# EAGLE design keyboard (EAGLE 9.5.1)

## Sheet 1 of 5
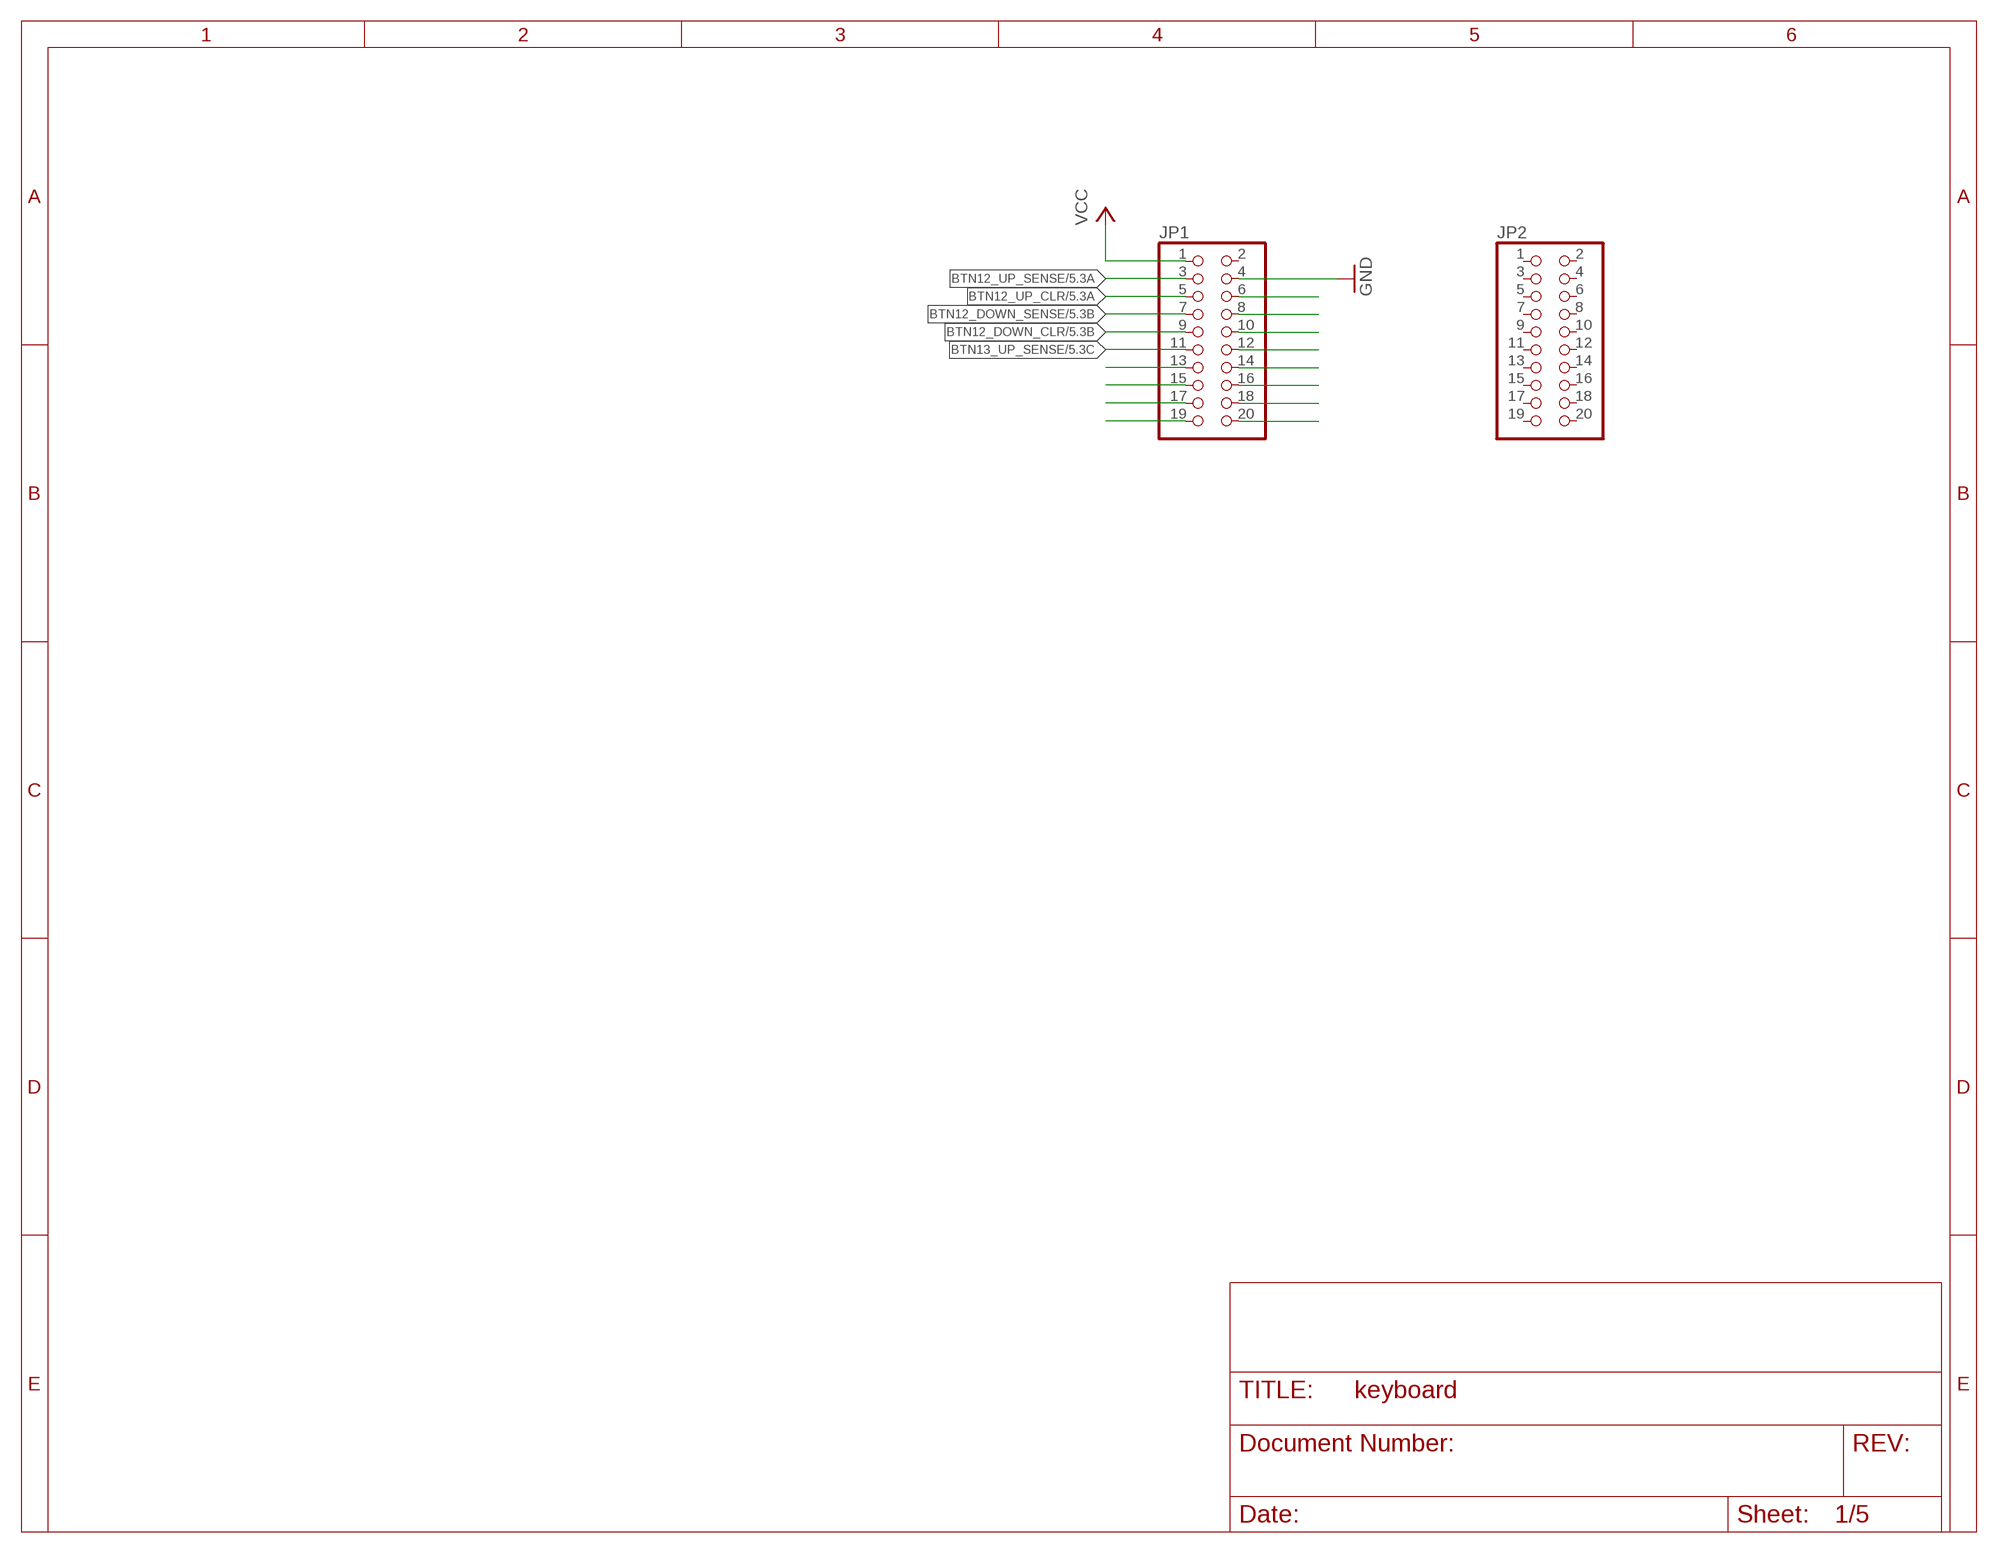
[diagram p0: schematic, sheet 1]

### Parts
JP1  PINHD-2X10  [2X10]
JP2  PINHD-2X10  [2X10]

### Nets
BTN12_DOWN_CLR: JP1.9 ; also sheet 5
BTN12_DOWN_SENSE: JP1.7 ; also sheet 5
BTN12_UP_CLR: JP1.5 ; also sheet 5
BTN12_UP_SENSE: JP1.3 ; also sheet 5
BTN13_UP_SENSE: JP1.11 ; also sheet 5
GND: JP1.4 ; also sheet 2,3,4,5
N$4: JP1.6
N$5: JP1.8
N$6: JP1.10
N$7: JP1.12
N$10: JP1.13
N$11: JP1.15
N$12: JP1.17
N$13: JP1.19
N$14: JP1.14
N$15: JP1.16
N$16: JP1.18
N$17: JP1.20
VCC: JP1.1 ; also sheet 2,3,4,5
Unconnected: JP1.2 JP2.1 JP2.2 JP2.3 JP2.4 JP2.5 JP2.6 JP2.7 JP2.8 JP2.9 JP2.10 JP2.11 JP2.12 JP2.13 JP2.14 JP2.15 JP2.16 JP2.17 JP2.18 JP2.19 JP2.20

## Sheet 2 of 5
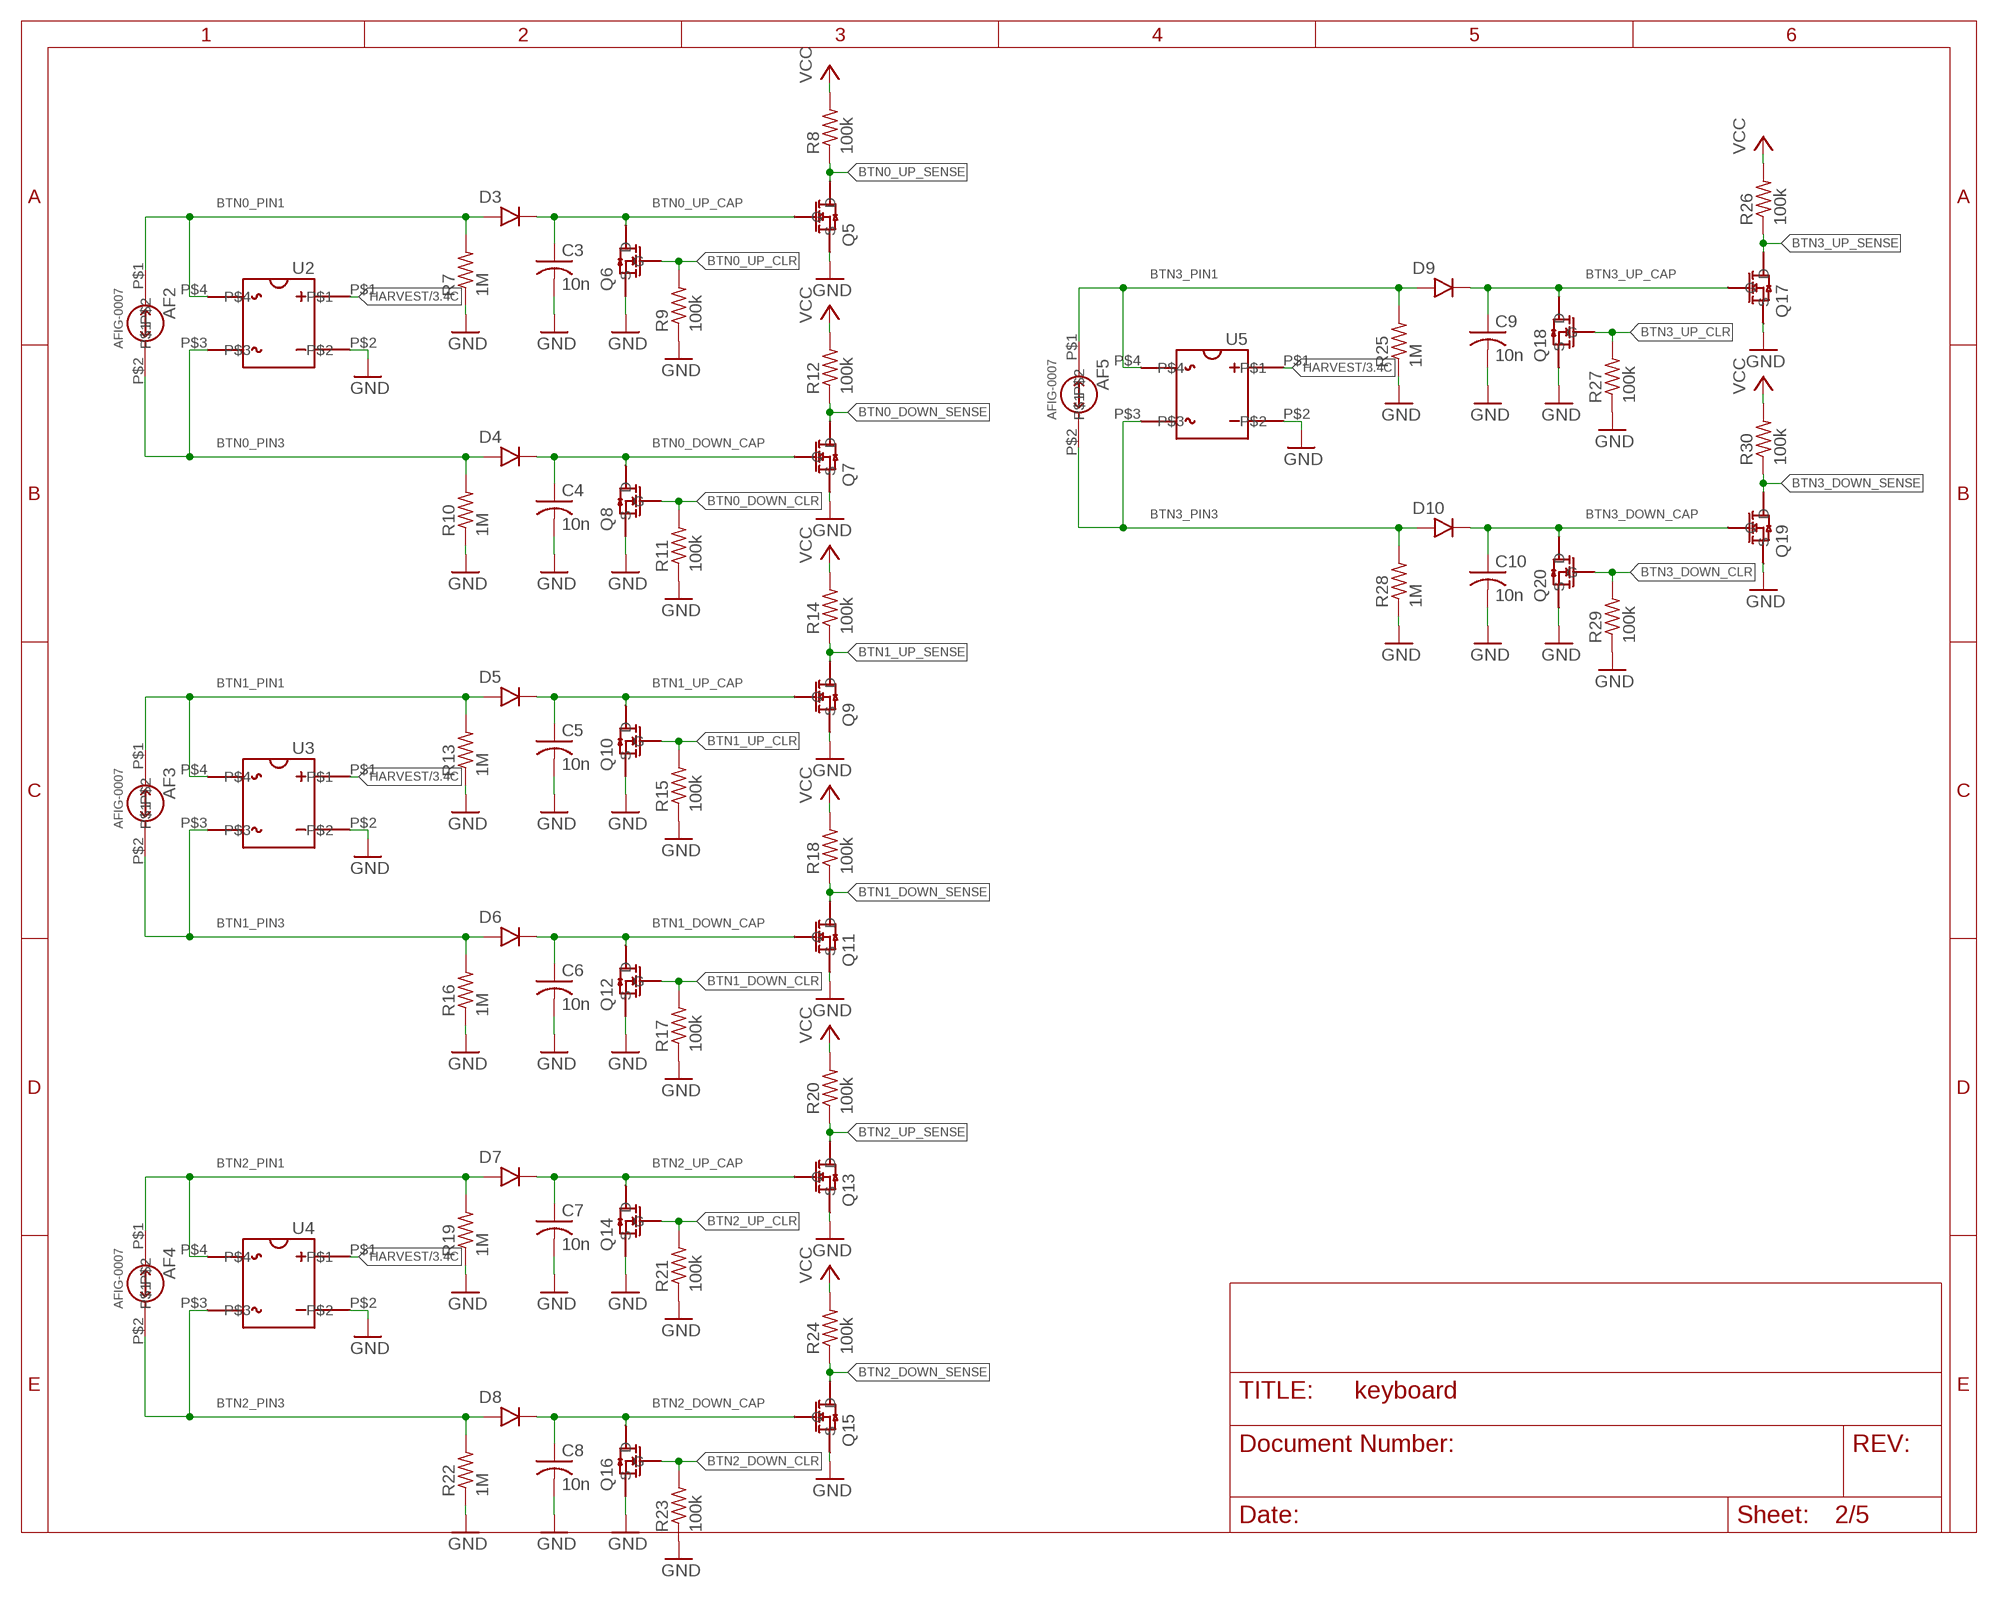
[diagram p1: schematic, sheet 2]

### Parts
AF2  BUTTON-MOUNT  [BUTTON-MOUNT]
AF3  BUTTON-MOUNT  [BUTTON-MOUNT]
AF4  BUTTON-MOUNT  [BUTTON-MOUNT]
AF5  BUTTON-MOUNT  [BUTTON-MOUNT]
C3  10n  C-USC0402  [C0402]
C4  10n  C-USC0402  [C0402]
C5  10n  C-USC0402  [C0402]
C6  10n  C-USC0402  [C0402]
C7  10n  C-USC0402  [C0402]
C8  10n  C-USC0402  [C0402]
C9  10n  C-USC0402  [C0402]
C10  10n  C-USC0402  [C0402]
D3  DFLU1200  [DFLU1200]
D4  DFLU1200  [DFLU1200]
D5  DFLU1200  [DFLU1200]
D6  DFLU1200  [DFLU1200]
D7  DFLU1200  [DFLU1200]
D8  DFLU1200  [DFLU1200]
D9  DFLU1200  [DFLU1200]
D10  DFLU1200  [DFLU1200]
Q5  2N7002K-7  [2N7002K-7]
Q6  BSS138K  [BSS138K]
Q7  2N7002K-7  [2N7002K-7]
Q8  BSS138K  [BSS138K]
Q9  2N7002K-7  [2N7002K-7]
Q10  BSS138K  [BSS138K]
Q11  2N7002K-7  [2N7002K-7]
Q12  BSS138K  [BSS138K]
Q13  2N7002K-7  [2N7002K-7]
Q14  BSS138K  [BSS138K]
Q15  2N7002K-7  [2N7002K-7]
Q16  BSS138K  [BSS138K]
Q17  2N7002K-7  [2N7002K-7]
Q18  BSS138K  [BSS138K]
Q19  2N7002K-7  [2N7002K-7]
Q20  BSS138K  [BSS138K]
R7  1M  R-US_R0402  [R0402]
R8  100k  R-US_R0402  [R0402]
R9  100k  R-US_R0402  [R0402]
R10  1M  R-US_R0402  [R0402]
R11  100k  R-US_R0402  [R0402]
R12  100k  R-US_R0402  [R0402]
R13  1M  R-US_R0402  [R0402]
R14  100k  R-US_R0402  [R0402]
R15  100k  R-US_R0402  [R0402]
R16  1M  R-US_R0402  [R0402]
R17  100k  R-US_R0402  [R0402]
R18  100k  R-US_R0402  [R0402]
R19  1M  R-US_R0402  [R0402]
R20  100k  R-US_R0402  [R0402]
R21  100k  R-US_R0402  [R0402]
R22  1M  R-US_R0402  [R0402]
R23  100k  R-US_R0402  [R0402]
R24  100k  R-US_R0402  [R0402]
R25  1M  R-US_R0402  [R0402]
R26  100k  R-US_R0402  [R0402]
R27  100k  R-US_R0402  [R0402]
R28  1M  R-US_R0402  [R0402]
R29  100k  R-US_R0402  [R0402]
R30  100k  R-US_R0402  [R0402]
U2  CDBHD140L-G  [CDBHDXX0L-G]
U3  CDBHD140L-G  [CDBHDXX0L-G]
U4  CDBHD140L-G  [CDBHDXX0L-G]
U5  CDBHD140L-G  [CDBHDXX0L-G]

### Nets
BTN0_DOWN_CAP: C4.1 D4.K Q7.G Q8.D
BTN0_DOWN_CLR: Q8.G R11.2
BTN0_DOWN_SENSE: Q7.D R12.1
BTN0_PIN1: AF2.P$1 D3.A R7.2 U2.P$4
BTN0_PIN3: AF2.P$2 D4.A R10.2 U2.P$3
BTN0_UP_CAP: C3.1 D3.K Q5.G Q6.D
BTN0_UP_CLR: Q6.G R9.2
BTN0_UP_SENSE: Q5.D R8.1
BTN1_DOWN_CAP: C6.1 D6.K Q11.G Q12.D
BTN1_DOWN_CLR: Q12.G R17.2
BTN1_DOWN_SENSE: Q11.D R18.1
BTN1_PIN1: AF3.P$1 D5.A R13.2 U3.P$4
BTN1_PIN3: AF3.P$2 D6.A R16.2 U3.P$3
BTN1_UP_CAP: C5.1 D5.K Q9.G Q10.D
BTN1_UP_CLR: Q10.G R15.2
BTN1_UP_SENSE: Q9.D R14.1
BTN2_DOWN_CAP: C8.1 D8.K Q15.G Q16.D
BTN2_DOWN_CLR: Q16.G R23.2
BTN2_DOWN_SENSE: Q15.D R24.1
BTN2_PIN1: AF4.P$1 D7.A R19.2 U4.P$4
BTN2_PIN3: AF4.P$2 D8.A R22.2 U4.P$3
BTN2_UP_CAP: C7.1 D7.K Q13.G Q14.D
BTN2_UP_CLR: Q14.G R21.2
BTN2_UP_SENSE: Q13.D R20.1
BTN3_DOWN_CAP: C10.1 D10.K Q19.G Q20.D
BTN3_DOWN_CLR: Q20.G R29.2
BTN3_DOWN_SENSE: Q19.D R30.1
BTN3_PIN1: AF5.P$1 D9.A R25.2 U5.P$4
BTN3_PIN3: AF5.P$2 D10.A R28.2 U5.P$3
BTN3_UP_CAP: C9.1 D9.K Q17.G Q18.D
BTN3_UP_CLR: Q18.G R27.2
BTN3_UP_SENSE: Q17.D R26.1
GND: C3.2 C4.2 C5.2 C6.2 C7.2 C8.2 C9.2 C10.2 Q5.S Q6.S Q7.S Q8.S Q9.S Q10.S Q11.S Q12.S Q13.S Q14.S Q15.S Q16.S Q17.S Q18.S Q19.S Q20.S R7.1 R9.1 R10.1 R11.1 R13.1 R15.1 R16.1 R17.1 R19.1 R21.1 R22.1 R23.1 R25.1 R27.1 R28.1 R29.1 U2.P$2 U3.P$2 U4.P$2 U5.P$2 ; also sheet 1,3,4,5
HARVEST: U2.P$1 U3.P$1 U4.P$1 U5.P$1 ; also sheet 3,4,5
VCC: R8.2 R12.2 R14.2 R18.2 R20.2 R24.2 R26.2 R30.2 ; also sheet 1,3,4,5

## Sheet 3 of 5
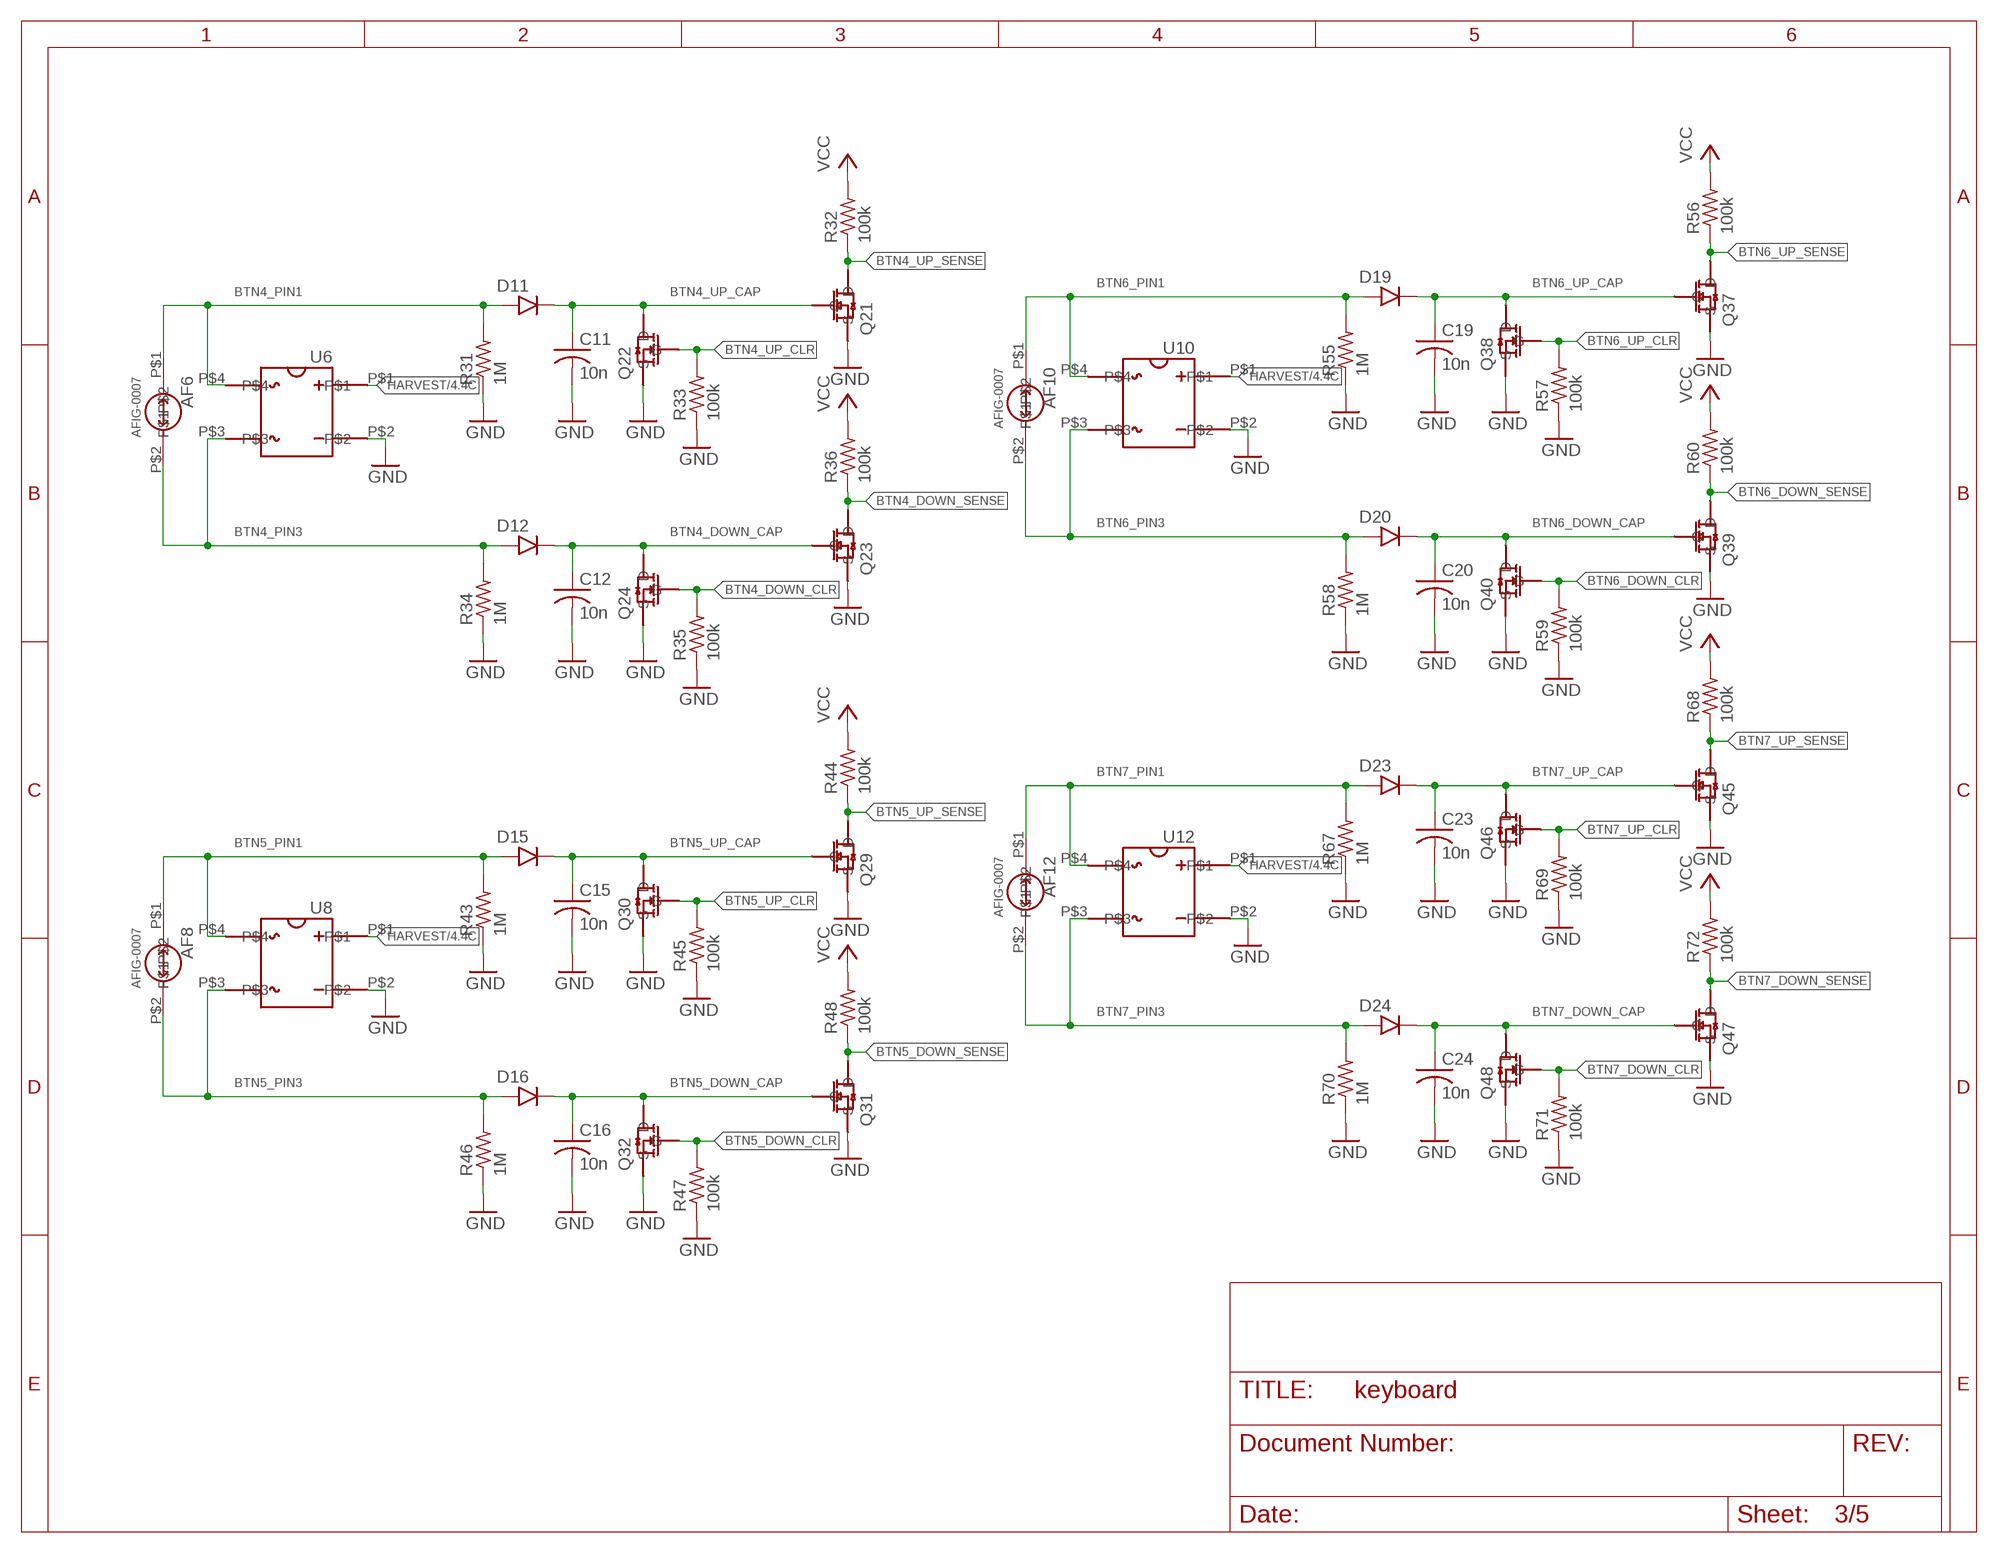
[diagram p2: schematic, sheet 3]

### Parts
AF6  BUTTON-MOUNT  [BUTTON-MOUNT]
AF8  BUTTON-MOUNT  [BUTTON-MOUNT]
AF10  BUTTON-MOUNT  [BUTTON-MOUNT]
AF12  BUTTON-MOUNT  [BUTTON-MOUNT]
C11  10n  C-USC0402  [C0402]
C12  10n  C-USC0402  [C0402]
C15  10n  C-USC0402  [C0402]
C16  10n  C-USC0402  [C0402]
C19  10n  C-USC0402  [C0402]
C20  10n  C-USC0402  [C0402]
C23  10n  C-USC0402  [C0402]
C24  10n  C-USC0402  [C0402]
D11  DFLU1200  [DFLU1200]
D12  DFLU1200  [DFLU1200]
D15  DFLU1200  [DFLU1200]
D16  DFLU1200  [DFLU1200]
D19  DFLU1200  [DFLU1200]
D20  DFLU1200  [DFLU1200]
D23  DFLU1200  [DFLU1200]
D24  DFLU1200  [DFLU1200]
Q21  2N7002K-7  [2N7002K-7]
Q22  BSS138K  [BSS138K]
Q23  2N7002K-7  [2N7002K-7]
Q24  BSS138K  [BSS138K]
Q29  2N7002K-7  [2N7002K-7]
Q30  BSS138K  [BSS138K]
Q31  2N7002K-7  [2N7002K-7]
Q32  BSS138K  [BSS138K]
Q37  2N7002K-7  [2N7002K-7]
Q38  BSS138K  [BSS138K]
Q39  2N7002K-7  [2N7002K-7]
Q40  BSS138K  [BSS138K]
Q45  2N7002K-7  [2N7002K-7]
Q46  BSS138K  [BSS138K]
Q47  2N7002K-7  [2N7002K-7]
Q48  BSS138K  [BSS138K]
R31  1M  R-US_R0402  [R0402]
R32  100k  R-US_R0402  [R0402]
R33  100k  R-US_R0402  [R0402]
R34  1M  R-US_R0402  [R0402]
R35  100k  R-US_R0402  [R0402]
R36  100k  R-US_R0402  [R0402]
R43  1M  R-US_R0402  [R0402]
R44  100k  R-US_R0402  [R0402]
R45  100k  R-US_R0402  [R0402]
R46  1M  R-US_R0402  [R0402]
R47  100k  R-US_R0402  [R0402]
R48  100k  R-US_R0402  [R0402]
R55  1M  R-US_R0402  [R0402]
R56  100k  R-US_R0402  [R0402]
R57  100k  R-US_R0402  [R0402]
R58  1M  R-US_R0402  [R0402]
R59  100k  R-US_R0402  [R0402]
R60  100k  R-US_R0402  [R0402]
R67  1M  R-US_R0402  [R0402]
R68  100k  R-US_R0402  [R0402]
R69  100k  R-US_R0402  [R0402]
R70  1M  R-US_R0402  [R0402]
R71  100k  R-US_R0402  [R0402]
R72  100k  R-US_R0402  [R0402]
U6  CDBHD140L-G  [CDBHDXX0L-G]
U8  CDBHD140L-G  [CDBHDXX0L-G]
U10  CDBHD140L-G  [CDBHDXX0L-G]
U12  CDBHD140L-G  [CDBHDXX0L-G]

### Nets
BTN4_DOWN_CAP: C12.1 D12.K Q23.G Q24.D
BTN4_DOWN_CLR: Q24.G R35.2
BTN4_DOWN_SENSE: Q23.D R36.1
BTN4_PIN1: AF6.P$1 D11.A R31.2 U6.P$4
BTN4_PIN3: AF6.P$2 D12.A R34.2 U6.P$3
BTN4_UP_CAP: C11.1 D11.K Q21.G Q22.D
BTN4_UP_CLR: Q22.G R33.2
BTN4_UP_SENSE: Q21.D R32.1
BTN5_DOWN_CAP: C16.1 D16.K Q31.G Q32.D
BTN5_DOWN_CLR: Q32.G R47.2
BTN5_DOWN_SENSE: Q31.D R48.1
BTN5_PIN1: AF8.P$1 D15.A R43.2 U8.P$4
BTN5_PIN3: AF8.P$2 D16.A R46.2 U8.P$3
BTN5_UP_CAP: C15.1 D15.K Q29.G Q30.D
BTN5_UP_CLR: Q30.G R45.2
BTN5_UP_SENSE: Q29.D R44.1
BTN6_DOWN_CAP: C20.1 D20.K Q39.G Q40.D
BTN6_DOWN_CLR: Q40.G R59.2
BTN6_DOWN_SENSE: Q39.D R60.1
BTN6_PIN1: AF10.P$1 D19.A R55.2 U10.P$4
BTN6_PIN3: AF10.P$2 D20.A R58.2 U10.P$3
BTN6_UP_CAP: C19.1 D19.K Q37.G Q38.D
BTN6_UP_CLR: Q38.G R57.2
BTN6_UP_SENSE: Q37.D R56.1
BTN7_DOWN_CAP: C24.1 D24.K Q47.G Q48.D
BTN7_DOWN_CLR: Q48.G R71.2
BTN7_DOWN_SENSE: Q47.D R72.1
BTN7_PIN1: AF12.P$1 D23.A R67.2 U12.P$4
BTN7_PIN3: AF12.P$2 D24.A R70.2 U12.P$3
BTN7_UP_CAP: C23.1 D23.K Q45.G Q46.D
BTN7_UP_CLR: Q46.G R69.2
BTN7_UP_SENSE: Q45.D R68.1
GND: C11.2 C12.2 C15.2 C16.2 C19.2 C20.2 C23.2 C24.2 Q21.S Q22.S Q23.S Q24.S Q29.S Q30.S Q31.S Q32.S Q37.S Q38.S Q39.S Q40.S Q45.S Q46.S Q47.S Q48.S R31.1 R33.1 R34.1 R35.1 R43.1 R45.1 R46.1 R47.1 R55.1 R57.1 R58.1 R59.1 R67.1 R69.1 R70.1 R71.1 U6.P$2 U8.P$2 U10.P$2 U12.P$2 ; also sheet 1,2,4,5
HARVEST: U6.P$1 U8.P$1 U10.P$1 U12.P$1 ; also sheet 2,4,5
VCC: R32.2 R36.2 R44.2 R48.2 R56.2 R60.2 R68.2 R72.2 ; also sheet 1,2,4,5

## Sheet 4 of 5
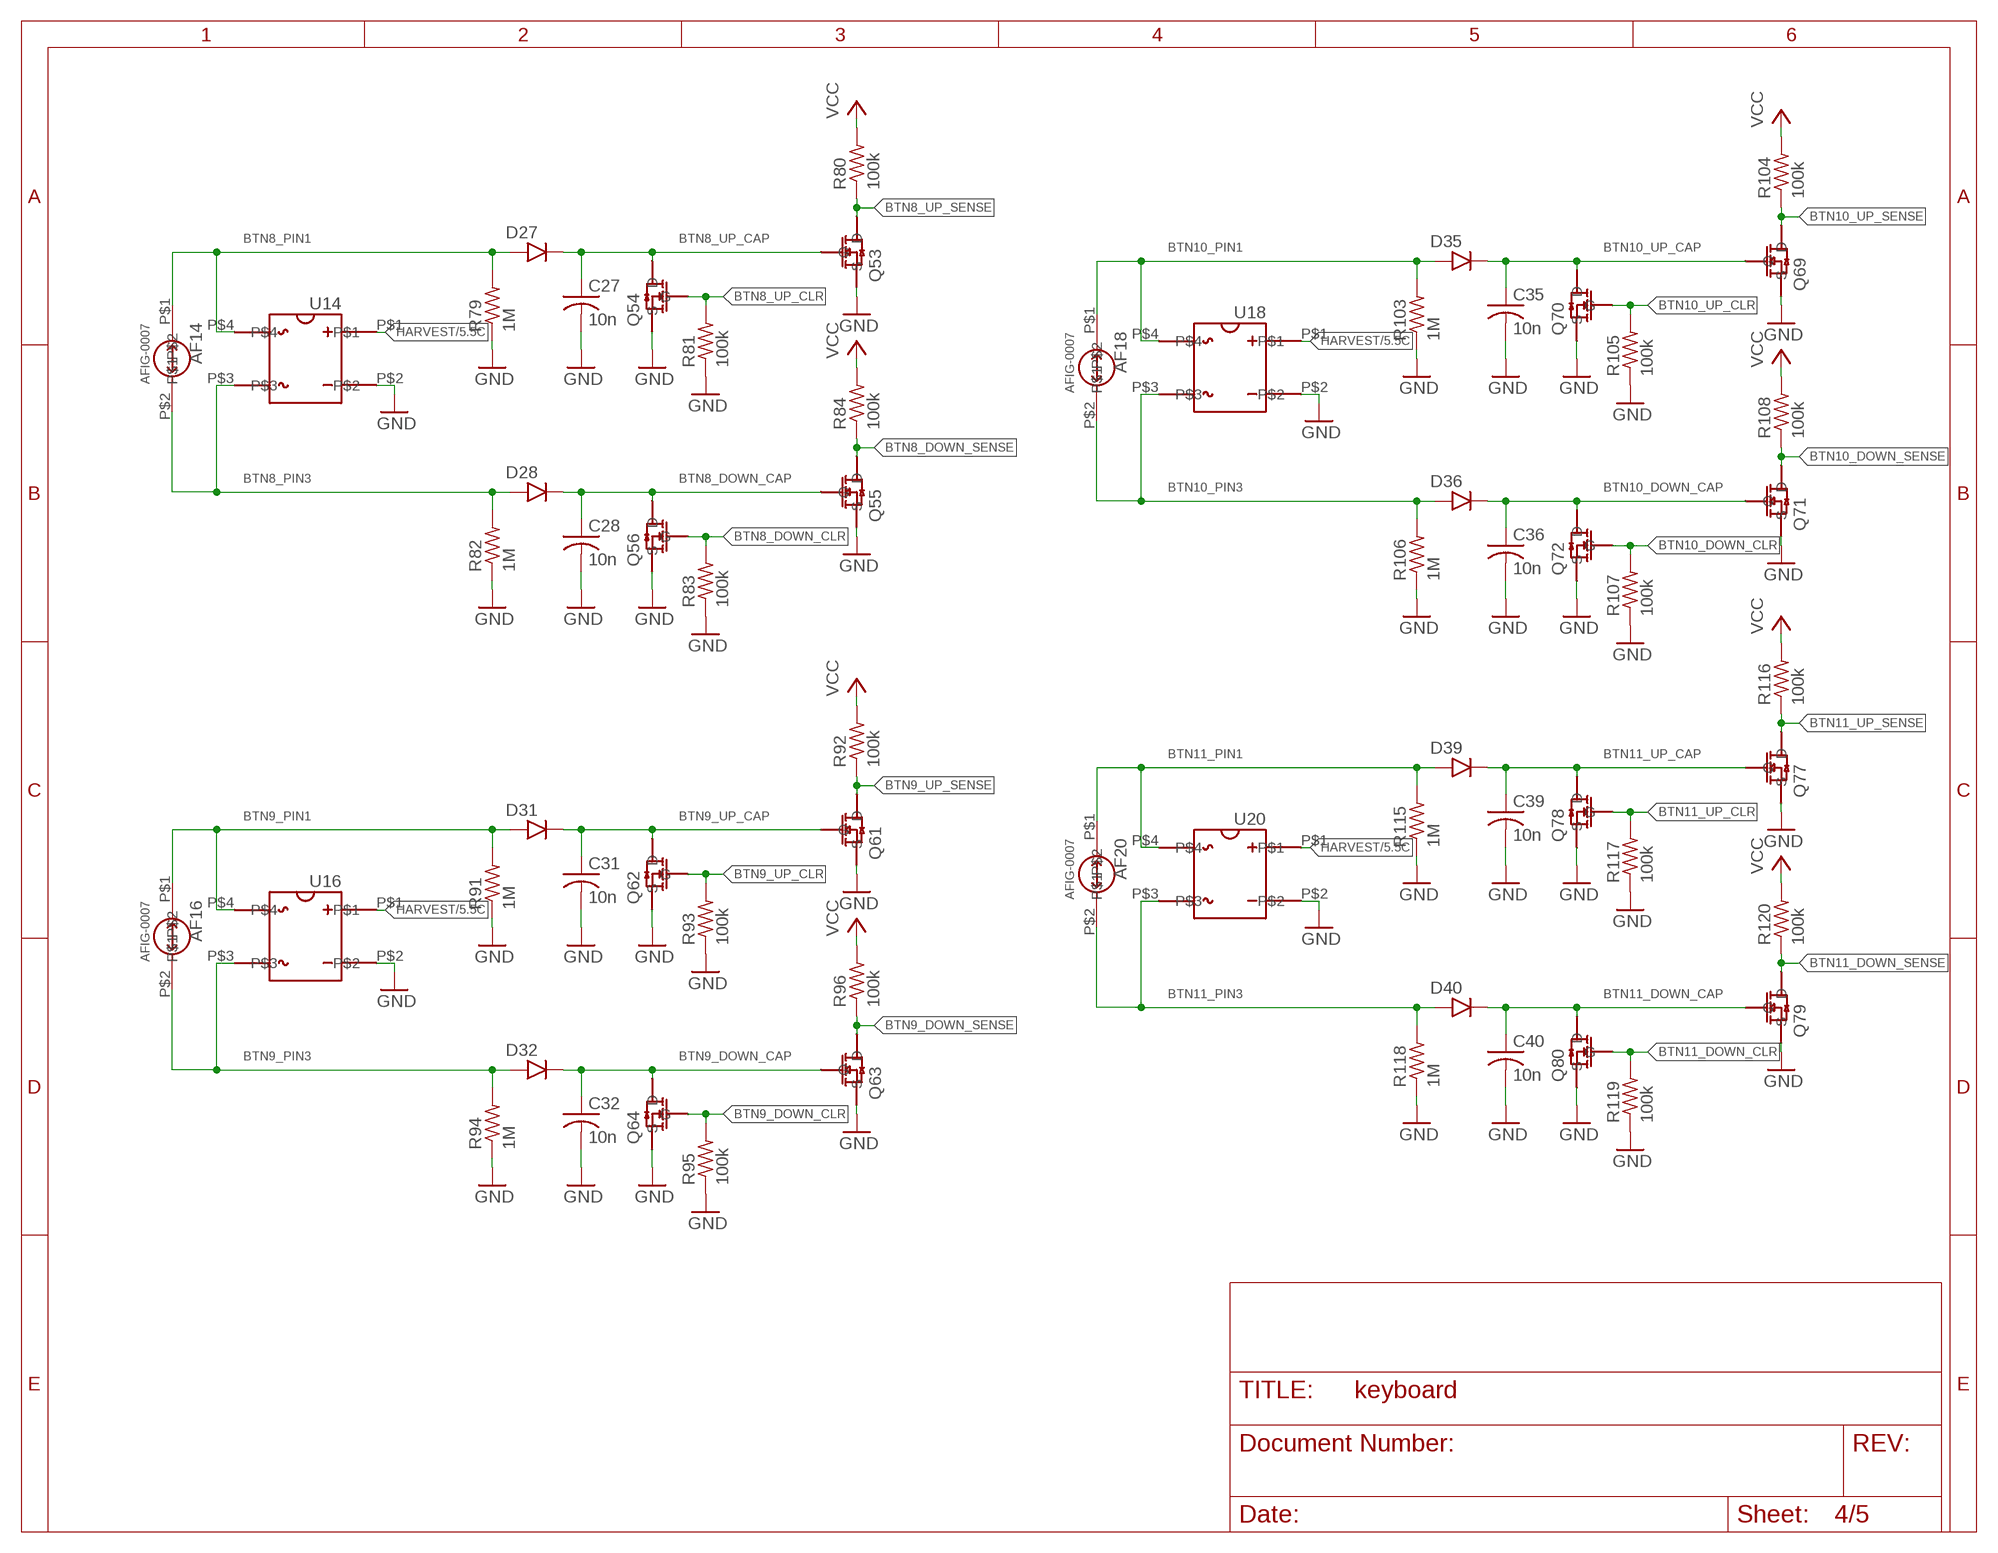
[diagram p3: schematic, sheet 4]

### Parts
AF14  BUTTON-MOUNT  [BUTTON-MOUNT]
AF16  BUTTON-MOUNT  [BUTTON-MOUNT]
AF18  BUTTON-MOUNT  [BUTTON-MOUNT]
AF20  BUTTON-MOUNT  [BUTTON-MOUNT]
C27  10n  C-USC0402  [C0402]
C28  10n  C-USC0402  [C0402]
C31  10n  C-USC0402  [C0402]
C32  10n  C-USC0402  [C0402]
C35  10n  C-USC0402  [C0402]
C36  10n  C-USC0402  [C0402]
C39  10n  C-USC0402  [C0402]
C40  10n  C-USC0402  [C0402]
D27  DFLU1200  [DFLU1200]
D28  DFLU1200  [DFLU1200]
D31  DFLU1200  [DFLU1200]
D32  DFLU1200  [DFLU1200]
D35  DFLU1200  [DFLU1200]
D36  DFLU1200  [DFLU1200]
D39  DFLU1200  [DFLU1200]
D40  DFLU1200  [DFLU1200]
Q53  2N7002K-7  [2N7002K-7]
Q54  BSS138K  [BSS138K]
Q55  2N7002K-7  [2N7002K-7]
Q56  BSS138K  [BSS138K]
Q61  2N7002K-7  [2N7002K-7]
Q62  BSS138K  [BSS138K]
Q63  2N7002K-7  [2N7002K-7]
Q64  BSS138K  [BSS138K]
Q69  2N7002K-7  [2N7002K-7]
Q70  BSS138K  [BSS138K]
Q71  2N7002K-7  [2N7002K-7]
Q72  BSS138K  [BSS138K]
Q77  2N7002K-7  [2N7002K-7]
Q78  BSS138K  [BSS138K]
Q79  2N7002K-7  [2N7002K-7]
Q80  BSS138K  [BSS138K]
R79  1M  R-US_R0402  [R0402]
R80  100k  R-US_R0402  [R0402]
R81  100k  R-US_R0402  [R0402]
R82  1M  R-US_R0402  [R0402]
R83  100k  R-US_R0402  [R0402]
R84  100k  R-US_R0402  [R0402]
R91  1M  R-US_R0402  [R0402]
R92  100k  R-US_R0402  [R0402]
R93  100k  R-US_R0402  [R0402]
R94  1M  R-US_R0402  [R0402]
R95  100k  R-US_R0402  [R0402]
R96  100k  R-US_R0402  [R0402]
R103  1M  R-US_R0402  [R0402]
R104  100k  R-US_R0402  [R0402]
R105  100k  R-US_R0402  [R0402]
R106  1M  R-US_R0402  [R0402]
R107  100k  R-US_R0402  [R0402]
R108  100k  R-US_R0402  [R0402]
R115  1M  R-US_R0402  [R0402]
R116  100k  R-US_R0402  [R0402]
R117  100k  R-US_R0402  [R0402]
R118  1M  R-US_R0402  [R0402]
R119  100k  R-US_R0402  [R0402]
R120  100k  R-US_R0402  [R0402]
U14  CDBHD140L-G  [CDBHDXX0L-G]
U16  CDBHD140L-G  [CDBHDXX0L-G]
U18  CDBHD140L-G  [CDBHDXX0L-G]
U20  CDBHD140L-G  [CDBHDXX0L-G]

### Nets
BTN8_DOWN_CAP: C28.1 D28.K Q55.G Q56.D
BTN8_DOWN_CLR: Q56.G R83.2
BTN8_DOWN_SENSE: Q55.D R84.1
BTN8_PIN1: AF14.P$1 D27.A R79.2 U14.P$4
BTN8_PIN3: AF14.P$2 D28.A R82.2 U14.P$3
BTN8_UP_CAP: C27.1 D27.K Q53.G Q54.D
BTN8_UP_CLR: Q54.G R81.2
BTN8_UP_SENSE: Q53.D R80.1
BTN9_DOWN_CAP: C32.1 D32.K Q63.G Q64.D
BTN9_DOWN_CLR: Q64.G R95.2
BTN9_DOWN_SENSE: Q63.D R96.1
BTN9_PIN1: AF16.P$1 D31.A R91.2 U16.P$4
BTN9_PIN3: AF16.P$2 D32.A R94.2 U16.P$3
BTN9_UP_CAP: C31.1 D31.K Q61.G Q62.D
BTN9_UP_CLR: Q62.G R93.2
BTN9_UP_SENSE: Q61.D R92.1
BTN10_DOWN_CAP: C36.1 D36.K Q71.G Q72.D
BTN10_DOWN_CLR: Q72.G R107.2
BTN10_DOWN_SENSE: Q71.D R108.1
BTN10_PIN1: AF18.P$1 D35.A R103.2 U18.P$4
BTN10_PIN3: AF18.P$2 D36.A R106.2 U18.P$3
BTN10_UP_CAP: C35.1 D35.K Q69.G Q70.D
BTN10_UP_CLR: Q70.G R105.2
BTN10_UP_SENSE: Q69.D R104.1
BTN11_DOWN_CAP: C40.1 D40.K Q79.G Q80.D
BTN11_DOWN_CLR: Q80.G R119.2
BTN11_DOWN_SENSE: Q79.D R120.1
BTN11_PIN1: AF20.P$1 D39.A R115.2 U20.P$4
BTN11_PIN3: AF20.P$2 D40.A R118.2 U20.P$3
BTN11_UP_CAP: C39.1 D39.K Q77.G Q78.D
BTN11_UP_CLR: Q78.G R117.2
BTN11_UP_SENSE: Q77.D R116.1
GND: C27.2 C28.2 C31.2 C32.2 C35.2 C36.2 C39.2 C40.2 Q53.S Q54.S Q55.S Q56.S Q61.S Q62.S Q63.S Q64.S Q69.S Q70.S Q71.S Q72.S Q77.S Q78.S Q79.S Q80.S R79.1 R81.1 R82.1 R83.1 R91.1 R93.1 R94.1 R95.1 R103.1 R105.1 R106.1 R107.1 R115.1 R117.1 R118.1 R119.1 U14.P$2 U16.P$2 U18.P$2 U20.P$2 ; also sheet 1,2,3,5
HARVEST: U14.P$1 U16.P$1 U18.P$1 U20.P$1 ; also sheet 2,3,5
VCC: R80.2 R84.2 R92.2 R96.2 R104.2 R108.2 R116.2 R120.2 ; also sheet 1,2,3,5

## Sheet 5 of 5
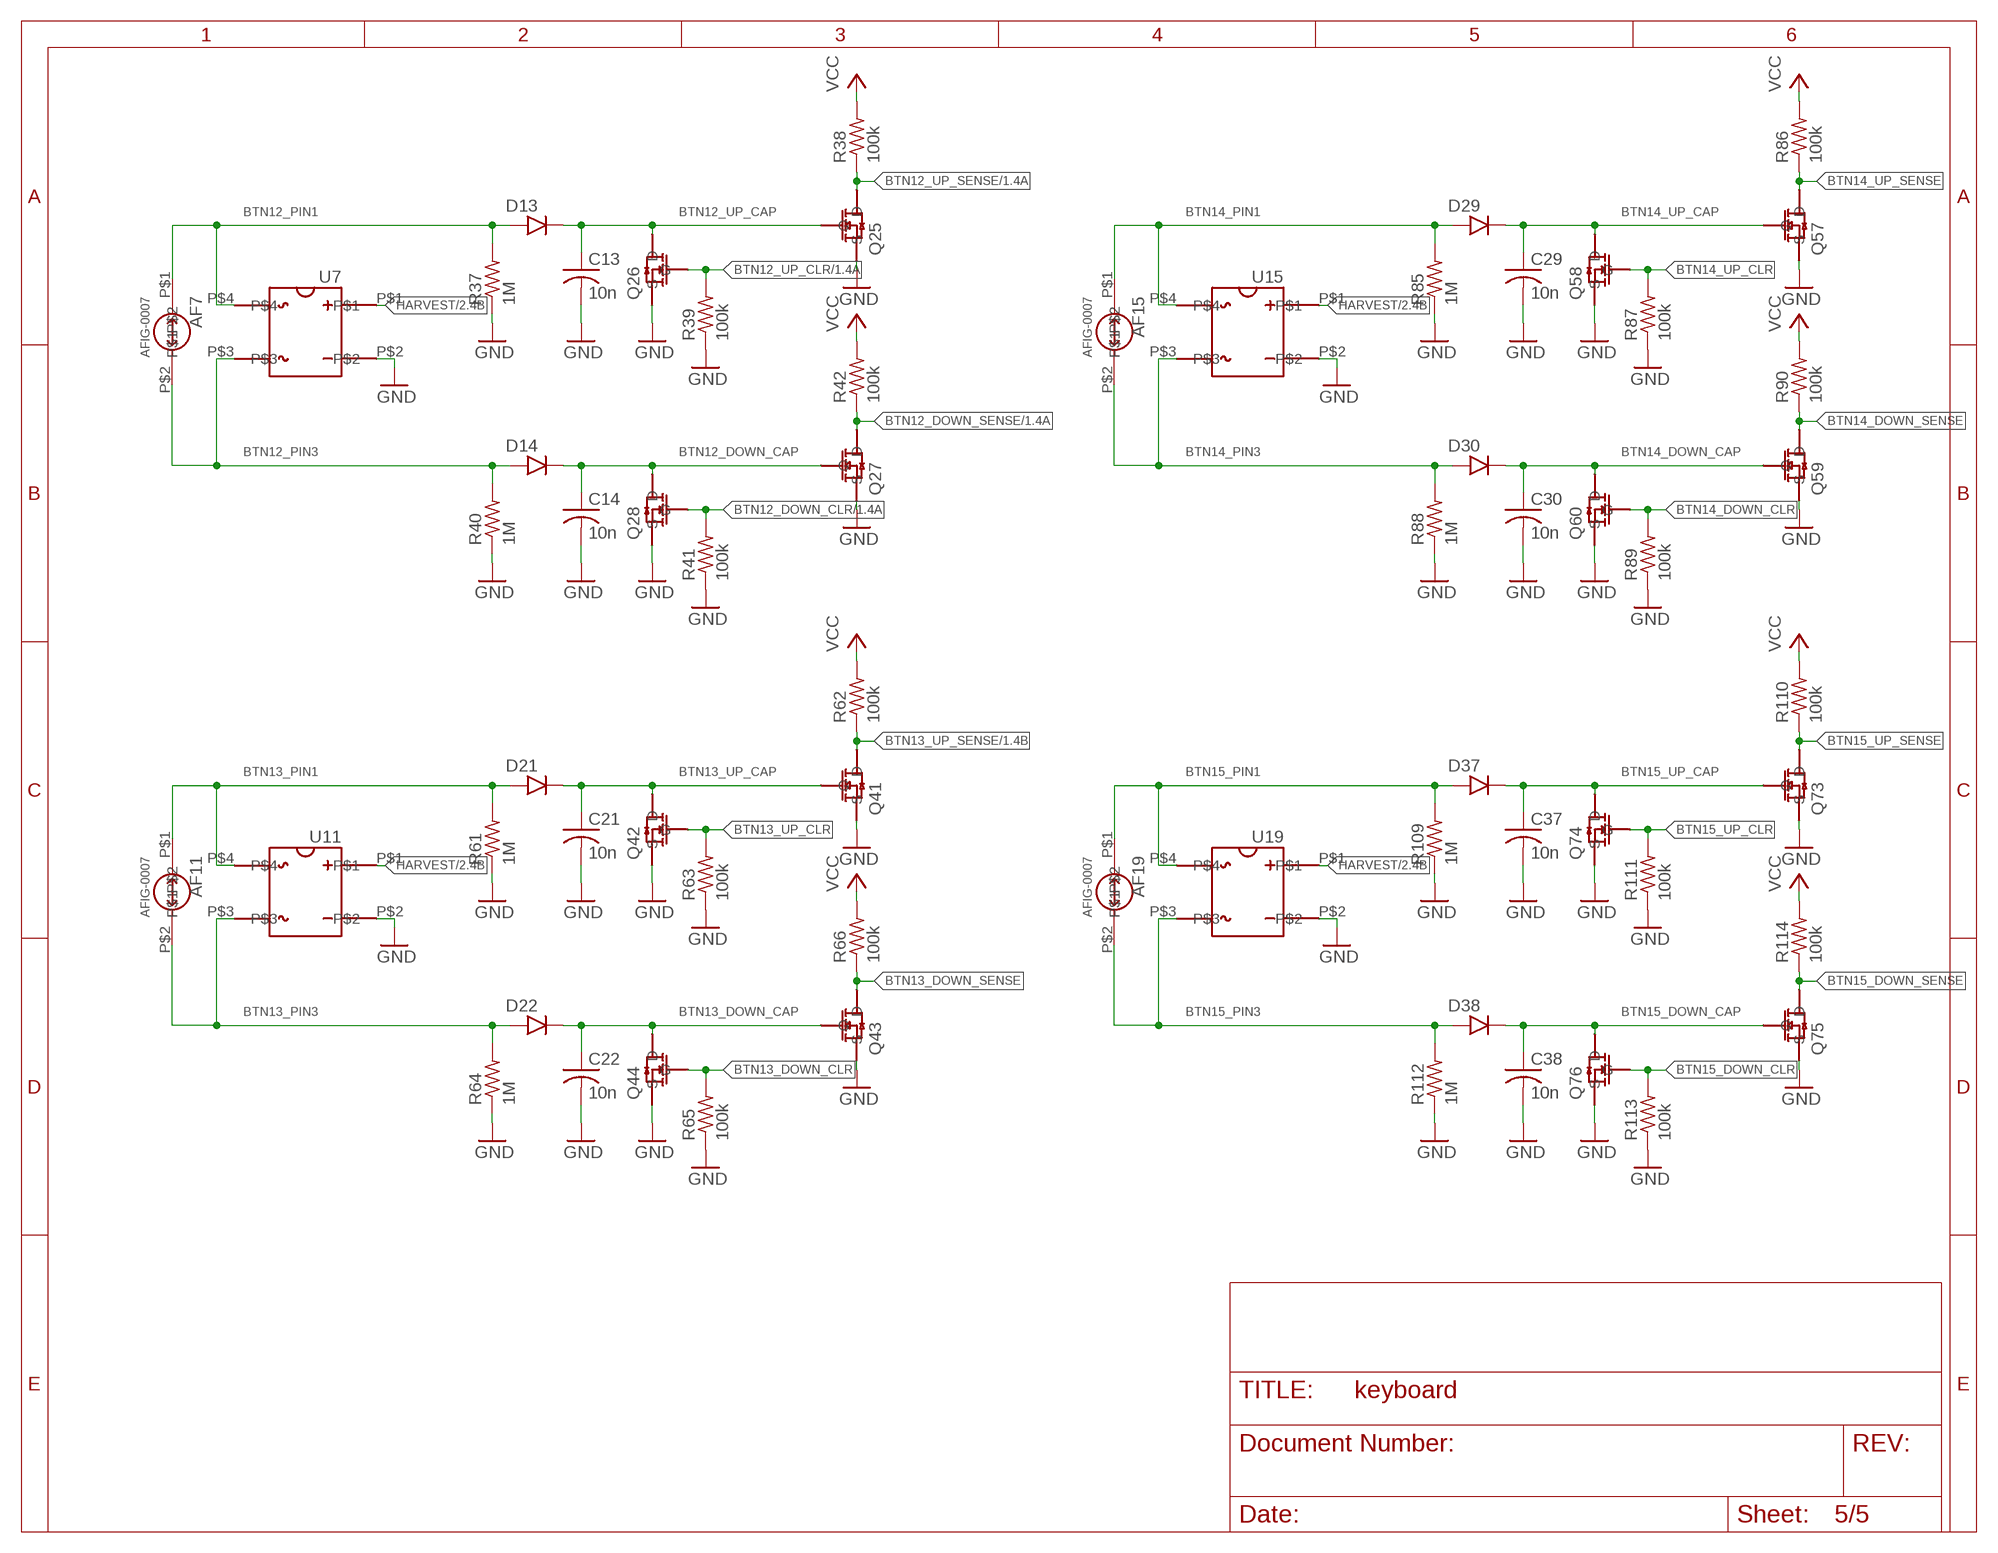
[diagram p4: schematic, sheet 5]

### Parts
AF7  BUTTON-MOUNT  [BUTTON-MOUNT]
AF11  BUTTON-MOUNT  [BUTTON-MOUNT]
AF15  BUTTON-MOUNT  [BUTTON-MOUNT]
AF19  BUTTON-MOUNT  [BUTTON-MOUNT]
C13  10n  C-USC0402  [C0402]
C14  10n  C-USC0402  [C0402]
C21  10n  C-USC0402  [C0402]
C22  10n  C-USC0402  [C0402]
C29  10n  C-USC0402  [C0402]
C30  10n  C-USC0402  [C0402]
C37  10n  C-USC0402  [C0402]
C38  10n  C-USC0402  [C0402]
D13  DFLU1200  [DFLU1200]
D14  DFLU1200  [DFLU1200]
D21  DFLU1200  [DFLU1200]
D22  DFLU1200  [DFLU1200]
D29  DFLU1200  [DFLU1200]
D30  DFLU1200  [DFLU1200]
D37  DFLU1200  [DFLU1200]
D38  DFLU1200  [DFLU1200]
Q25  2N7002K-7  [2N7002K-7]
Q26  BSS138K  [BSS138K]
Q27  2N7002K-7  [2N7002K-7]
Q28  BSS138K  [BSS138K]
Q41  2N7002K-7  [2N7002K-7]
Q42  BSS138K  [BSS138K]
Q43  2N7002K-7  [2N7002K-7]
Q44  BSS138K  [BSS138K]
Q57  2N7002K-7  [2N7002K-7]
Q58  BSS138K  [BSS138K]
Q59  2N7002K-7  [2N7002K-7]
Q60  BSS138K  [BSS138K]
Q73  2N7002K-7  [2N7002K-7]
Q74  BSS138K  [BSS138K]
Q75  2N7002K-7  [2N7002K-7]
Q76  BSS138K  [BSS138K]
R37  1M  R-US_R0402  [R0402]
R38  100k  R-US_R0402  [R0402]
R39  100k  R-US_R0402  [R0402]
R40  1M  R-US_R0402  [R0402]
R41  100k  R-US_R0402  [R0402]
R42  100k  R-US_R0402  [R0402]
R61  1M  R-US_R0402  [R0402]
R62  100k  R-US_R0402  [R0402]
R63  100k  R-US_R0402  [R0402]
R64  1M  R-US_R0402  [R0402]
R65  100k  R-US_R0402  [R0402]
R66  100k  R-US_R0402  [R0402]
R85  1M  R-US_R0402  [R0402]
R86  100k  R-US_R0402  [R0402]
R87  100k  R-US_R0402  [R0402]
R88  1M  R-US_R0402  [R0402]
R89  100k  R-US_R0402  [R0402]
R90  100k  R-US_R0402  [R0402]
R109  1M  R-US_R0402  [R0402]
R110  100k  R-US_R0402  [R0402]
R111  100k  R-US_R0402  [R0402]
R112  1M  R-US_R0402  [R0402]
R113  100k  R-US_R0402  [R0402]
R114  100k  R-US_R0402  [R0402]
U7  CDBHD140L-G  [CDBHDXX0L-G]
U11  CDBHD140L-G  [CDBHDXX0L-G]
U15  CDBHD140L-G  [CDBHDXX0L-G]
U19  CDBHD140L-G  [CDBHDXX0L-G]

### Nets
BTN12_DOWN_CAP: C14.1 D14.K Q27.G Q28.D
BTN12_DOWN_CLR: Q28.G R41.2 ; also sheet 1
BTN12_DOWN_SENSE: Q27.D R42.1 ; also sheet 1
BTN12_PIN1: AF7.P$1 D13.A R37.2 U7.P$4
BTN12_PIN3: AF7.P$2 D14.A R40.2 U7.P$3
BTN12_UP_CAP: C13.1 D13.K Q25.G Q26.D
BTN12_UP_CLR: Q26.G R39.2 ; also sheet 1
BTN12_UP_SENSE: Q25.D R38.1 ; also sheet 1
BTN13_DOWN_CAP: C22.1 D22.K Q43.G Q44.D
BTN13_DOWN_CLR: Q44.G R65.2
BTN13_DOWN_SENSE: Q43.D R66.1
BTN13_PIN1: AF11.P$1 D21.A R61.2 U11.P$4
BTN13_PIN3: AF11.P$2 D22.A R64.2 U11.P$3
BTN13_UP_CAP: C21.1 D21.K Q41.G Q42.D
BTN13_UP_CLR: Q42.G R63.2
BTN13_UP_SENSE: Q41.D R62.1 ; also sheet 1
BTN14_DOWN_CAP: C30.1 D30.K Q59.G Q60.D
BTN14_DOWN_CLR: Q60.G R89.2
BTN14_DOWN_SENSE: Q59.D R90.1
BTN14_PIN1: AF15.P$1 D29.A R85.2 U15.P$4
BTN14_PIN3: AF15.P$2 D30.A R88.2 U15.P$3
BTN14_UP_CAP: C29.1 D29.K Q57.G Q58.D
BTN14_UP_CLR: Q58.G R87.2
BTN14_UP_SENSE: Q57.D R86.1
BTN15_DOWN_CAP: C38.1 D38.K Q75.G Q76.D
BTN15_DOWN_CLR: Q76.G R113.2
BTN15_DOWN_SENSE: Q75.D R114.1
BTN15_PIN1: AF19.P$1 D37.A R109.2 U19.P$4
BTN15_PIN3: AF19.P$2 D38.A R112.2 U19.P$3
BTN15_UP_CAP: C37.1 D37.K Q73.G Q74.D
BTN15_UP_CLR: Q74.G R111.2
BTN15_UP_SENSE: Q73.D R110.1
GND: C13.2 C14.2 C21.2 C22.2 C29.2 C30.2 C37.2 C38.2 Q25.S Q26.S Q27.S Q28.S Q41.S Q42.S Q43.S Q44.S Q57.S Q58.S Q59.S Q60.S Q73.S Q74.S Q75.S Q76.S R37.1 R39.1 R40.1 R41.1 R61.1 R63.1 R64.1 R65.1 R85.1 R87.1 R88.1 R89.1 R109.1 R111.1 R112.1 R113.1 U7.P$2 U11.P$2 U15.P$2 U19.P$2 ; also sheet 1,2,3,4
HARVEST: U7.P$1 U11.P$1 U15.P$1 U19.P$1 ; also sheet 2,3,4
VCC: R38.2 R42.2 R62.2 R66.2 R86.2 R90.2 R110.2 R114.2 ; also sheet 1,2,3,4

## Library data of the parts
AF2-AF8 AF10-AF12 AF14-AF16 AF18-AF20 = afig-0007:BUTTON-MOUNT
C3-C16 C19-C24 C27-C32 C35-C40 = rcl:C-US: CAPACITOR, American symbol; SPICEPREFIX: C
D3-D16 D19-D24 D27-D32 D35-D40 = afig-0007:DFLU1200
JP1 JP2 = pinhead:PINHD-2X10: PIN HEADER
Q5 Q7 Q9 Q11 Q13 Q15 Q17 Q19 Q21 Q23 Q25 Q27 Q29 Q31 Q37 Q39 Q41 Q43 Q45 Q47 Q53 Q55 Q57 Q59 Q61 Q63 Q69 Q71 Q73 Q75 Q77 Q79 = afig-0007:2N7002K-7
Q6 Q8 Q10 Q12 Q14 Q16 Q18 Q20 Q22 Q24 Q26 Q28 Q30 Q32 Q38 Q40 Q42 Q44 Q46 Q48 Q54 Q56 Q58 Q60 Q62 Q64 Q70 Q72 Q74 Q76 Q78 Q80 = afig-0007:BSS138K
R7-R48 R55-R72 R79-R96 R103-R120 = rcl:R-US_: RESISTOR, American symbol; SPICEPREFIX: R
U2-U8 U10-U12 U14-U16 U18-U20 = afig-0007:CDBHD140L-G

## Board
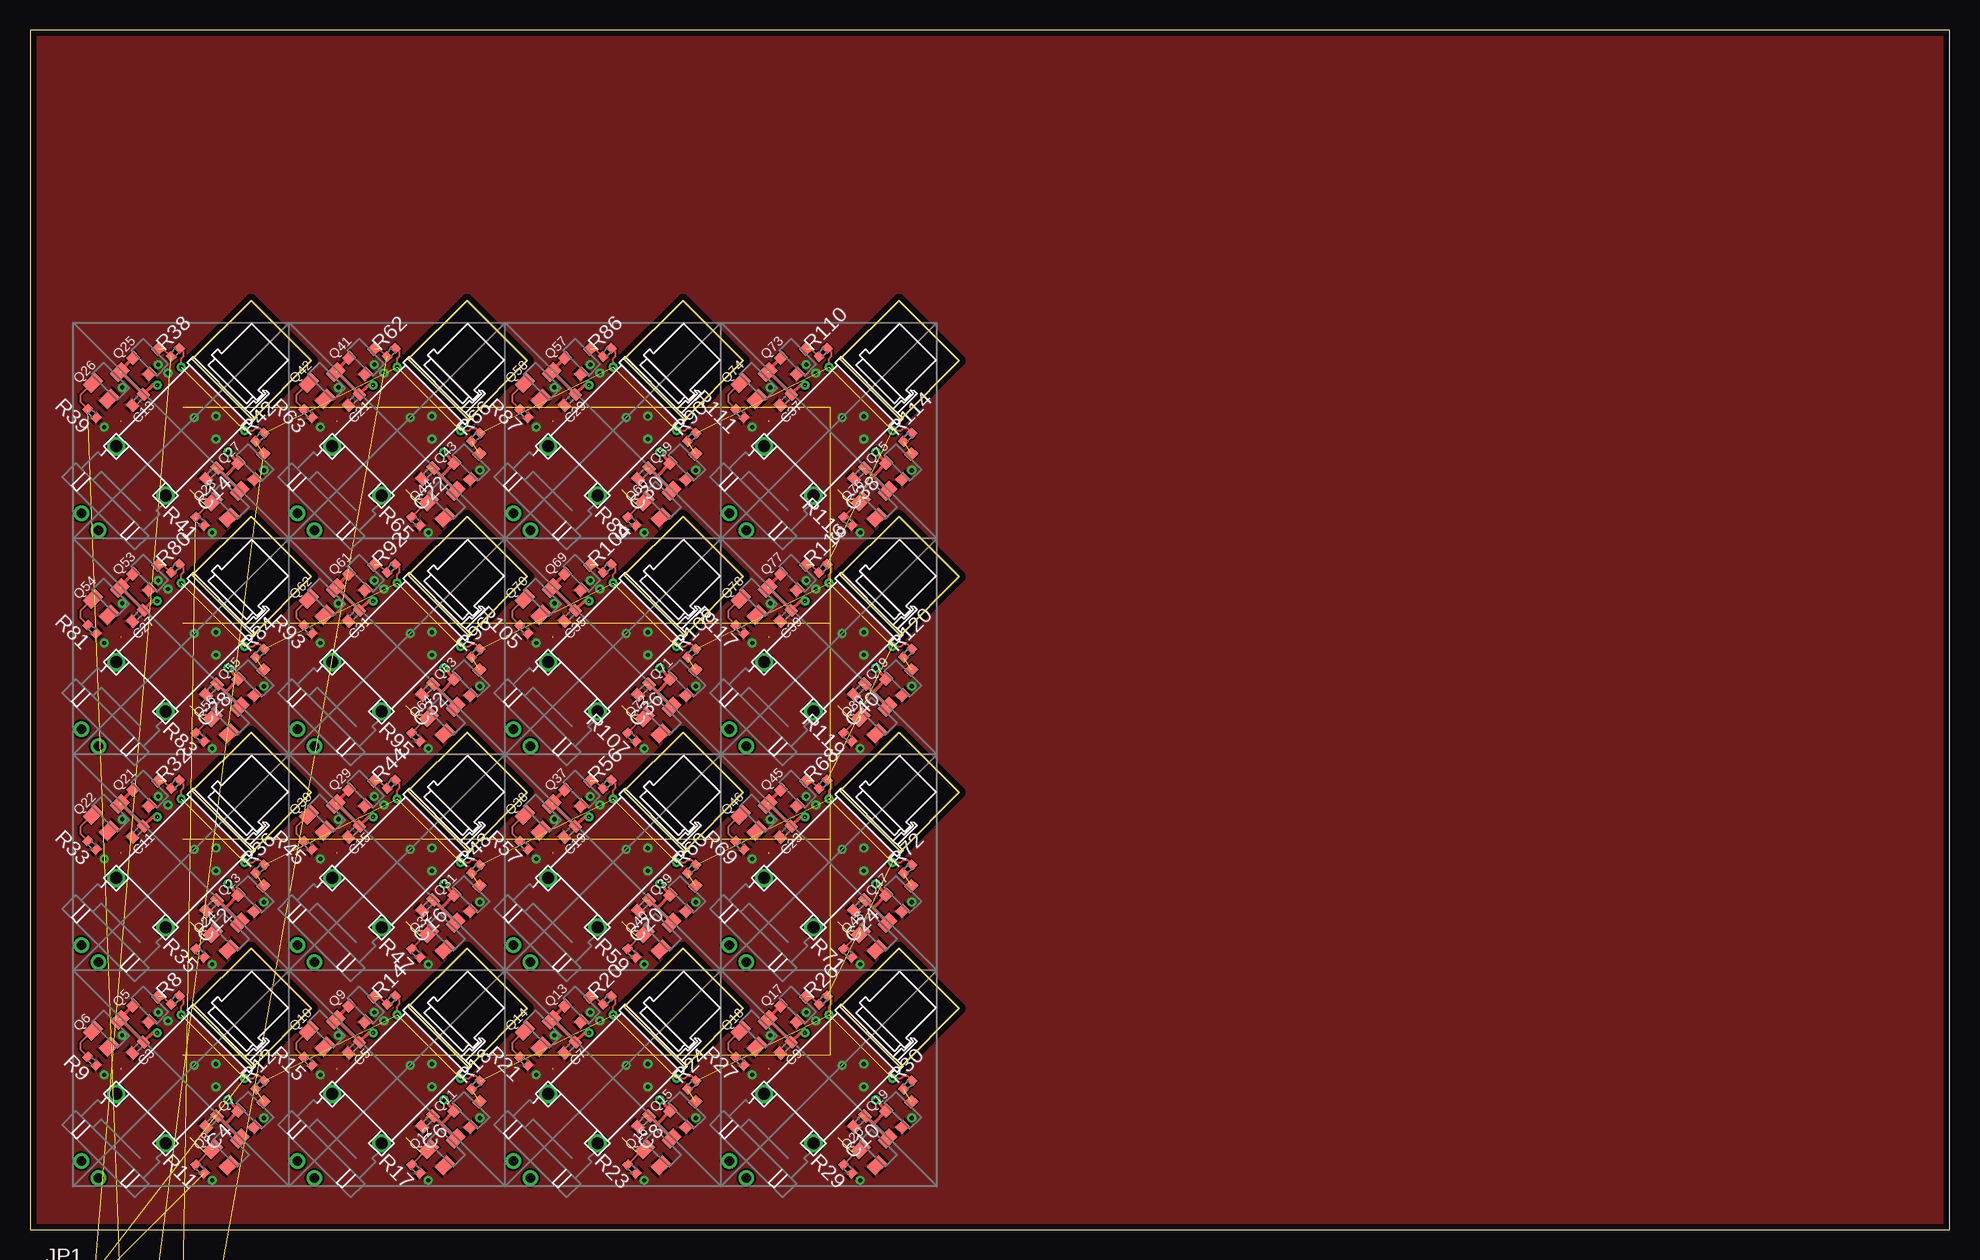
[diagram p5: board, top side]
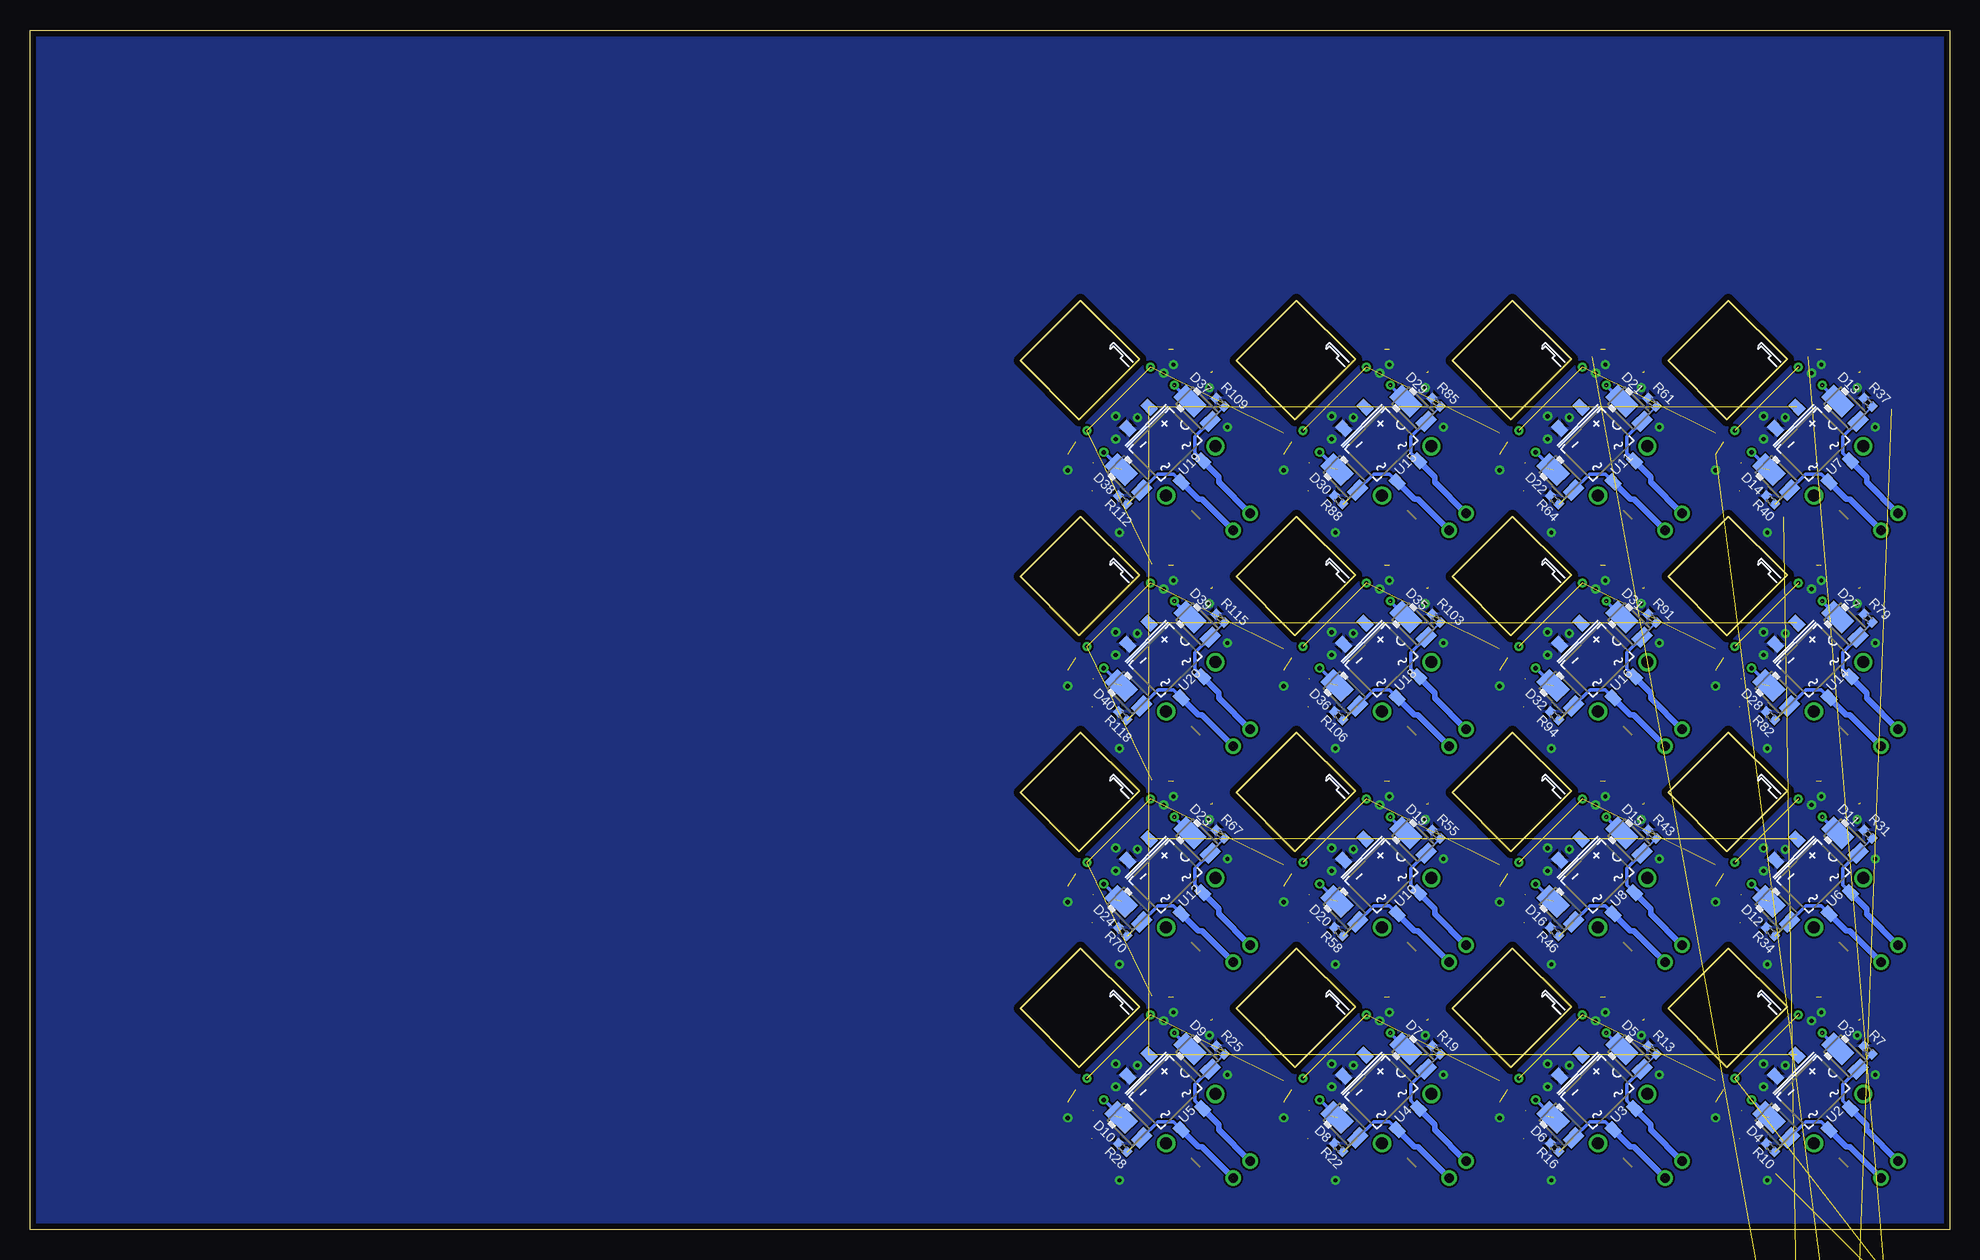
[diagram p6: board, bottom side, seen from below]

Size 160 x 100 mm. Coordinates in mm from the lower left corner, seen from the top.
Outline: 0,0 160,0 160,100 0,100 0,0
Copper layers (1*16): Top 0.035mm / dielectric 1.5mm / Bottom 0.035mm
Design rules "default *": minimum track width 6mil, minimum drill 0.35mm, track to track 6mil, track to pad 6mil, pad to pad 6mil, via to via 6mil, smd to smd 6mil, copper to edge 20mil, drill to drill 6mil, minimum pad ring 10mil, minimum via ring 8mil, stop-mask expansion 4mil, vias tented up to drill 0mil, thermal gap 10mil

### Footprints (pad centres in the part's own frame; a part is rotated, then mirrored left to right if it is on the bottom)
BUTTON-MOUNT = drill 0.8: P$1 0,1; P$2 0,-1 | drill 1: P$3 6,-2.9; P$4 6,2.9
C0402 = smd 0.7 x 0.9: 1 -0.65,0; 2 0.65,0
DFLU1200 = smd 1.05 x 1.5: A -1.55,0 | smd 2.4 x 1.5: K 0.85,0
2X10 = drill 1.016 octagon: 1 -11.43,-1.27; 2 -11.43,1.27; 3 -8.89,-1.27; 4 -8.89,1.27; 5 -6.35,-1.27; 6 -6.35,1.27; 7 -3.81,-1.27; 8 -3.81,1.27; 9 -1.27,-1.27; 10 -1.27,1.27; 11 1.27,-1.27; 12 1.27,1.27; 13 3.81,-1.27; 14 3.81,1.27; 15 6.35,-1.27; 16 6.35,1.27; 17 8.89,-1.27; 18 8.89,1.27; 19 11.43,-1.27; 20 11.43,1.27
2N7002K-7 = smd 0.8 x 0.9: D 0,1; G -0.95,-1; S 0.95,-1
BSS138K = smd 1 x 1.4: D 0,1.1; G -0.95,-1.1; S 0.95,-1.1
R0402 = smd 0.6 x 0.7: 1 -0.5,0; 2 0.5,0
CDBHDXX0L-G = smd 0.85 x 1.2: P$1 1.25,3.15; P$2 -1.25,3.15; P$3 -1.25,-3.15; P$4 1.25,-3.15

### Placement (x,y rotation side)
AF2  5,5 45 top
AF3  23,5 45 top
AF4  41,5 45 top
AF5  59,5 45 top
AF6  5,23 45 top
AF7  5,59 45 top
AF8  23,23 45 top
AF10  41,23 45 top
AF11  23,59 45 top
AF12  59,23 45 top
AF14  5,41 45 top
AF15  41,59 45 top
AF16  23,41 45 top
AF18  41,41 45 top
AF19  59,59 45 top
AF20  59,41 45 top
C3  8.99,15.17 225 top
C4  15.15,9.02 225 top
C5  26.99,15.17 225 top
C6  33.15,9.02 225 top
C7  44.99,15.17 225 top
C8  51.15,9.02 225 top
C9  62.99,15.17 225 top
C10  69.15,9.02 225 top
C11  8.99,33.17 225 top
C12  15.15,27.02 225 top
C13  8.99,69.17 225 top
C14  15.15,63.02 225 top
C15  26.99,33.17 225 top
C16  33.15,27.02 225 top
C19  44.99,33.17 225 top
C20  51.15,27.02 225 top
C21  26.99,69.17 225 top
C22  33.15,63.02 225 top
C23  62.99,33.17 225 top
C24  69.15,27.02 225 top
C27  8.99,51.17 225 top
C28  15.15,45.02 225 top
C29  44.99,69.17 225 top
C30  51.15,63.02 225 top
C31  26.99,51.17 225 top
C32  33.15,45.02 225 top
C35  44.99,51.17 225 top
C36  51.15,45.02 225 top
C37  62.99,69.17 225 top
C38  69.15,63.02 225 top
C39  62.99,51.17 225 top
C40  69.15,45.02 225 top
D3  8.71,14.46 135 bottom
D4  14.44,8.74 135 bottom
D5  26.71,14.46 135 bottom
D6  32.44,8.74 135 bottom
D7  44.71,14.46 135 bottom
D8  50.44,8.74 135 bottom
D9  62.71,14.46 135 bottom
D10  68.44,8.74 135 bottom
D11  8.71,32.46 135 bottom
D12  14.44,26.74 135 bottom
D13  8.71,68.46 135 bottom
D14  14.44,62.74 135 bottom
D15  26.71,32.46 135 bottom
D16  32.44,26.74 135 bottom
D19  44.71,32.46 135 bottom
D20  50.44,26.74 135 bottom
D21  26.71,68.46 135 bottom
D22  32.44,62.74 135 bottom
D23  62.71,32.46 135 bottom
D24  68.44,26.74 135 bottom
D27  8.71,50.46 135 bottom
D28  14.44,44.74 135 bottom
D29  44.71,68.46 135 bottom
D30  50.44,62.74 135 bottom
D31  26.71,50.46 135 bottom
D32  32.44,44.74 135 bottom
D35  44.71,50.46 135 bottom
D36  50.44,44.74 135 bottom
D37  62.71,68.46 135 bottom
D38  68.44,62.74 135 bottom
D39  62.71,50.46 135 bottom
D40  68.44,44.74 135 bottom
JP1  14,-6 0 top  (outside the outline)
JP2  14,-14 0 top  (outside the outline)
Q5  9.98,18.71 315 top
Q6  6.7,16.7 315 top
Q7  18.75,9.94 315 top
Q8  16.7,6.8 315 top
Q9  27.98,18.71 315 top
Q10  24.7,16.7 315 top
Q11  36.75,9.94 315 top
Q12  34.7,6.8 315 top
Q13  45.98,18.71 315 top
Q14  42.7,16.7 315 top
Q15  54.75,9.94 315 top
Q16  52.7,6.8 315 top
Q17  63.98,18.71 315 top
Q18  60.7,16.7 315 top
Q19  72.75,9.94 315 top
Q20  70.7,6.8 315 top
Q21  9.98,36.71 315 top
Q22  6.7,34.7 315 top
Q23  18.75,27.94 315 top
Q24  16.7,24.8 315 top
Q25  9.98,72.71 315 top
Q26  6.7,70.7 315 top
Q27  18.75,63.94 315 top
Q28  16.7,60.8 315 top
Q29  27.98,36.71 315 top
Q30  24.7,34.7 315 top
Q31  36.75,27.94 315 top
Q32  34.7,24.8 315 top
Q37  45.98,36.71 315 top
Q38  42.7,34.7 315 top
Q39  54.75,27.94 315 top
Q40  52.7,24.8 315 top
Q41  27.98,72.71 315 top
Q42  24.7,70.7 315 top
Q43  36.75,63.94 315 top
Q44  34.7,60.8 315 top
Q45  63.98,36.71 315 top
Q46  60.7,34.7 315 top
Q47  72.75,27.94 315 top
Q48  70.7,24.8 315 top
Q53  9.98,54.71 315 top
Q54  6.7,52.7 315 top
Q55  18.75,45.94 315 top
Q56  16.7,42.8 315 top
Q57  45.98,72.71 315 top
Q58  42.7,70.7 315 top
Q59  54.75,63.94 315 top
Q60  52.7,60.8 315 top
Q61  27.98,54.71 315 top
Q62  24.7,52.7 315 top
Q63  36.75,45.94 315 top
Q64  34.7,42.8 315 top
Q69  45.98,54.71 315 top
Q70  42.7,52.7 315 top
Q71  54.75,45.94 315 top
Q72  52.7,42.8 315 top
Q73  63.98,72.71 315 top
Q74  60.7,70.7 315 top
Q75  72.75,63.94 315 top
Q76  70.7,60.8 315 top
Q77  63.98,54.71 315 top
Q78  60.7,52.7 315 top
Q79  72.75,45.94 315 top
Q80  70.7,42.8 315 top
R7  6.8,14.96 315 bottom
R8  12.11,19.13 45 top
R9  5.18,14.04 135 top
R10  14.93,6.83 315 bottom
R11  14.16,5.06 135 top
R12  19.18,12.06 45 top
R13  24.8,14.96 315 bottom
R14  30.11,19.13 45 top
R15  23.18,14.04 135 top
R16  32.93,6.83 315 bottom
R17  32.16,5.06 135 top
R18  37.18,12.06 45 top
R19  42.8,14.96 315 bottom
R20  48.11,19.13 45 top
R21  41.18,14.04 135 top
R22  50.93,6.83 315 bottom
R23  50.16,5.06 135 top
R24  55.18,12.06 45 top
R25  60.8,14.96 315 bottom
R26  66.11,19.13 45 top
R27  59.18,14.04 135 top
R28  68.93,6.83 315 bottom
R29  68.16,5.06 135 top
R30  73.18,12.06 45 top
R31  6.8,32.96 315 bottom
R32  12.11,37.13 45 top
R33  5.18,32.04 135 top
R34  14.93,24.83 315 bottom
R35  14.16,23.06 135 top
R36  19.18,30.06 45 top
R37  6.8,68.96 315 bottom
R38  12.11,73.13 45 top
R39  5.18,68.04 135 top
R40  14.93,60.83 315 bottom
R41  14.16,59.06 135 top
R42  19.18,66.06 45 top
R43  24.8,32.96 315 bottom
R44  30.11,37.13 45 top
R45  23.18,32.04 135 top
R46  32.93,24.83 315 bottom
R47  32.16,23.06 135 top
R48  37.18,30.06 45 top
R55  42.8,32.96 315 bottom
R56  48.11,37.13 45 top
R57  41.18,32.04 135 top
R58  50.93,24.83 315 bottom
R59  50.16,23.06 135 top
R60  55.18,30.06 45 top
R61  24.8,68.96 315 bottom
R62  30.11,73.13 45 top
R63  23.18,68.04 135 top
R64  32.93,60.83 315 bottom
R65  32.16,59.06 135 top
R66  37.18,66.06 45 top
R67  60.8,32.96 315 bottom
R68  66.11,37.13 45 top
R69  59.18,32.04 135 top
R70  68.93,24.83 315 bottom
R71  68.16,23.06 135 top
R72  73.18,30.06 45 top
R79  6.8,50.96 315 bottom
R80  12.11,55.13 45 top
R81  5.18,50.04 135 top
R82  14.93,42.83 315 bottom
R83  14.16,41.06 135 top
R84  19.18,48.06 45 top
R85  42.8,68.96 315 bottom
R86  48.11,73.13 45 top
R87  41.18,68.04 135 top
R88  50.93,60.83 315 bottom
R89  50.16,59.06 135 top
R90  55.18,66.06 45 top
R91  24.8,50.96 315 bottom
R92  30.11,55.13 45 top
R93  23.18,50.04 135 top
R94  32.93,42.83 315 bottom
R95  32.16,41.06 135 top
R96  37.18,48.06 45 top
R103  42.8,50.96 315 bottom
R104  48.11,55.13 45 top
R105  41.18,50.04 135 top
R106  50.93,42.83 315 bottom
R107  50.16,41.06 135 top
R108  55.18,48.06 45 top
R109  60.8,68.96 315 bottom
R110  66.11,73.13 45 top
R111  59.18,68.04 135 top
R112  68.93,60.83 315 bottom
R113  68.16,59.06 135 top
R114  73.18,66.06 45 top
R115  60.8,50.96 315 bottom
R116  66.11,55.13 45 top
R117  59.18,50.04 135 top
R118  68.93,42.83 315 bottom
R119  68.16,41.06 135 top
R120  73.18,48.06 45 top
U2  11.37,11.43 45 bottom
U3  29.37,11.43 45 bottom
U4  47.37,11.43 45 bottom
U5  65.37,11.43 45 bottom
U6  11.37,29.43 45 bottom
U7  11.37,65.43 45 bottom
U8  29.37,29.43 45 bottom
U10  47.37,29.43 45 bottom
U11  29.37,65.43 45 bottom
U12  65.37,29.43 45 bottom
U14  11.37,47.43 45 bottom
U15  47.37,65.43 45 bottom
U16  29.37,47.43 45 bottom
U18  47.37,47.43 45 bottom
U19  65.37,65.43 45 bottom
U20  65.37,47.43 45 bottom

### Tracks (layer width: path | path; a pad name or v marks a point on that pad's centre or on a via)
BTN0_DOWN_CAP  (via drill 0.35)  (4 unrouted)
  Top 0.305: C4.1 17.48,7.61 | Q7.G 16.29,8.82 | v16.5,10.8 17.37,9.93
  Bottom 0.305: D4.K v16.5,10.8
BTN0_DOWN_CLR  (1 unrouted)
  Top 0.152: R11.2 15.08,6.69
BTN0_DOWN_SENSE  (1 unrouted)
BTN0_PIN1  (2 unrouted)
  Bottom 0.152: R7.2 7.62,13.44
  Bottom 0.305: D3.A 8.9,12.08 8.9,10.73 U2.P$4
  Bottom 0.457: U2.P$4 6.9,8.73 6.9,8.3 4.31,5.71
BTN0_PIN3  (3 unrouted)
  Bottom 0.152: 14.51,6.47 13.39,7.59
  Bottom 0.305: U2.P$3 10.71,9 11.98,9 13.39,7.59
  Bottom 0.457: U2.P$3 8.61,6.9 8.3,6.9 5.71,4.31
BTN0_UP_CAP  (via drill 0.35)  (3 unrouted)
  Top 0.305: 7.61,17.48 C3.1 10.22,16.4 v10.6,16.4 | Q5.G 7.48,17.55
  Bottom 0.305: D3.K 10.6,16.35
BTN0_UP_CLR
  Top 0.152: Q6.G 4.2,15.54 4.2,15.02 R9.2
BTN0_UP_SENSE  (1 unrouted)
  Top 0.152: 11.12,19.41 R8.1
BTN1_DOWN_CAP  (via drill 0.35)  (4 unrouted)
  Top 0.305: C6.1 35.48,7.61 | Q11.G 34.29,8.82 | v34.5,10.8 35.37,9.93
  Bottom 0.305: D6.K v34.5,10.8
BTN1_DOWN_CLR  (1 unrouted)
  Top 0.152: R17.2 33.08,6.69
BTN1_DOWN_SENSE  (1 unrouted)
BTN1_PIN1  (2 unrouted)
  Bottom 0.152: R13.2 25.61,13.44
  Bottom 0.305: D5.A 26.9,12.08 26.9,10.73 U3.P$4
  Bottom 0.457: U3.P$4 24.9,8.73 24.9,8.3 22.31,5.71
BTN1_PIN3  (3 unrouted)
  Bottom 0.152: 32.51,6.47 31.39,7.59
  Bottom 0.305: U3.P$3 28.71,9 29.98,9 31.39,7.59
  Bottom 0.457: U3.P$3 26.61,6.9 26.3,6.9 23.71,4.31
BTN1_UP_CAP  (via drill 0.35)  (3 unrouted)
  Top 0.305: 25.61,17.48 C5.1 28.22,16.4 v28.6,16.4 | Q9.G 25.48,17.55
  Bottom 0.305: D5.K 28.6,16.35
BTN1_UP_CLR
  Top 0.152: Q10.G 22.2,15.54 22.2,15.02 R15.2
BTN1_UP_SENSE  (1 unrouted)
  Top 0.152: 29.11,19.41 R14.1
BTN2_DOWN_CAP  (via drill 0.35)  (4 unrouted)
  Top 0.305: C8.1 53.48,7.61 | Q15.G 52.29,8.82 | v52.5,10.8 53.37,9.93
  Bottom 0.305: D8.K v52.5,10.8
BTN2_DOWN_CLR  (1 unrouted)
  Top 0.152: R23.2 51.08,6.69
BTN2_DOWN_SENSE  (1 unrouted)
BTN2_PIN1  (2 unrouted)
  Bottom 0.152: R19.2 43.62,13.44
  Bottom 0.305: D7.A 44.9,12.08 44.9,10.73 U4.P$4
  Bottom 0.457: U4.P$4 42.9,8.73 42.9,8.3 40.31,5.71
BTN2_PIN3  (3 unrouted)
  Bottom 0.152: 50.51,6.47 49.39,7.59
  Bottom 0.305: U4.P$3 46.71,9 47.98,9 49.39,7.59
  Bottom 0.457: U4.P$3 44.61,6.9 44.3,6.9 41.71,4.31
BTN2_UP_CAP  (via drill 0.35)  (3 unrouted)
  Top 0.305: 43.61,17.48 C7.1 46.22,16.4 v46.6,16.4 | Q13.G 43.48,17.55
  Bottom 0.305: D7.K 46.6,16.35
BTN2_UP_CLR
  Top 0.152: Q14.G 40.2,15.54 40.2,15.02 R21.2
BTN2_UP_SENSE  (1 unrouted)
  Top 0.152: 47.12,19.41 R20.1
BTN3_DOWN_CAP  (via drill 0.35)  (4 unrouted)
  Top 0.305: C10.1 71.48,7.61 | Q19.G 70.29,8.82 | v70.5,10.8 71.37,9.93
  Bottom 0.305: D10.K v70.5,10.8
BTN3_DOWN_CLR  (1 unrouted)
  Top 0.152: R29.2 69.08,6.69
BTN3_DOWN_SENSE  (1 unrouted)
BTN3_PIN1  (2 unrouted)
  Bottom 0.152: R25.2 61.62,13.44
  Bottom 0.305: D9.A 62.9,12.08 62.9,10.73 U5.P$4
  Bottom 0.457: U5.P$4 60.9,8.73 60.9,8.3 58.31,5.71
BTN3_PIN3  (3 unrouted)
  Bottom 0.152: 68.51,6.47 67.39,7.59
  Bottom 0.305: U5.P$3 64.71,9 65.98,9 67.39,7.59
  Bottom 0.457: U5.P$3 62.61,6.9 62.3,6.9 59.71,4.31
BTN3_UP_CAP  (via drill 0.35)  (3 unrouted)
  Top 0.305: 61.61,17.48 C9.1 64.22,16.4 v64.6,16.4 | Q17.G 61.48,17.55
  Bottom 0.305: D9.K 64.6,16.35
BTN3_UP_CLR
  Top 0.152: Q18.G 58.2,15.54 58.2,15.02 R27.2
BTN3_UP_SENSE  (1 unrouted)
  Top 0.152: 65.11,19.41 R26.1
BTN4_DOWN_CAP  (via drill 0.35)  (4 unrouted)
  Top 0.305: C12.1 17.48,25.61 | Q23.G 16.29,26.82 | v16.5,28.8 17.37,27.93
  Bottom 0.305: D12.K v16.5,28.8
BTN4_DOWN_CLR  (1 unrouted)
  Top 0.152: R35.2 15.08,24.69
BTN4_DOWN_SENSE  (1 unrouted)
BTN4_PIN1  (2 unrouted)
  Bottom 0.152: R31.2 7.62,31.44
  Bottom 0.305: D11.A 8.9,30.08 8.9,28.73 U6.P$4
  Bottom 0.457: U6.P$4 6.9,26.73 6.9,26.3 4.31,23.71
BTN4_PIN3  (3 unrouted)
  Bottom 0.152: 14.51,24.48 13.39,25.59
  Bottom 0.305: U6.P$3 10.71,27 11.98,27 13.39,25.59
  Bottom 0.457: U6.P$3 8.61,24.9 8.3,24.9 5.71,22.31
BTN4_UP_CAP  (via drill 0.35)  (3 unrouted)
  Top 0.305: 7.61,35.48 C11.1 10.22,34.4 v10.6,34.4 | Q21.G 7.48,35.55
  Bottom 0.305: D11.K 10.6,34.35
BTN4_UP_CLR
  Top 0.152: Q22.G 4.2,33.54 4.2,33.02 R33.2
BTN4_UP_SENSE  (1 unrouted)
  Top 0.152: 11.12,37.41 R32.1
BTN5_DOWN_CAP  (via drill 0.35)  (4 unrouted)
  Top 0.305: C16.1 35.48,25.61 | Q31.G 34.29,26.82 | v34.5,28.8 35.37,27.93
  Bottom 0.305: D16.K v34.5,28.8
BTN5_DOWN_CLR  (1 unrouted)
  Top 0.152: R47.2 33.08,24.69
BTN5_DOWN_SENSE  (1 unrouted)
BTN5_PIN1  (2 unrouted)
  Bottom 0.152: R43.2 25.61,31.44
  Bottom 0.305: D15.A 26.9,30.08 26.9,28.73 U8.P$4
  Bottom 0.457: U8.P$4 24.9,26.73 24.9,26.3 22.31,23.71
BTN5_PIN3  (3 unrouted)
  Bottom 0.152: 32.51,24.48 31.39,25.59
  Bottom 0.305: U8.P$3 28.71,27 29.98,27 31.39,25.59
  Bottom 0.457: U8.P$3 26.61,24.9 26.3,24.9 23.71,22.31
BTN5_UP_CAP  (via drill 0.35)  (3 unrouted)
  Top 0.305: 25.61,35.48 C15.1 28.22,34.4 v28.6,34.4 | Q29.G 25.48,35.55
  Bottom 0.305: D15.K 28.6,34.35
BTN5_UP_CLR
  Top 0.152: Q30.G 22.2,33.54 22.2,33.02 R45.2
BTN5_UP_SENSE  (1 unrouted)
  Top 0.152: 29.11,37.41 R44.1
BTN6_DOWN_CAP  (via drill 0.35)  (4 unrouted)
  Top 0.305: C20.1 53.48,25.61 | Q39.G 52.29,26.82 | v52.5,28.8 53.37,27.93
  Bottom 0.305: D20.K v52.5,28.8
BTN6_DOWN_CLR  (1 unrouted)
  Top 0.152: R59.2 51.08,24.69
BTN6_DOWN_SENSE  (1 unrouted)
BTN6_PIN1  (2 unrouted)
  Bottom 0.152: R55.2 43.62,31.44
  Bottom 0.305: D19.A 44.9,30.08 44.9,28.73 U10.P$4
  Bottom 0.457: U10.P$4 42.9,26.73 42.9,26.3 40.31,23.71
BTN6_PIN3  (3 unrouted)
  Bottom 0.152: 50.51,24.48 49.39,25.59
  Bottom 0.305: U10.P$3 46.71,27 47.98,27 49.39,25.59
  Bottom 0.457: U10.P$3 44.61,24.9 44.3,24.9 41.71,22.31
BTN6_UP_CAP  (via drill 0.35)  (3 unrouted)
  Top 0.305: 43.61,35.48 C19.1 46.22,34.4 v46.6,34.4 | Q37.G 43.48,35.55
  Bottom 0.305: D19.K 46.6,34.35
BTN6_UP_CLR
  Top 0.152: Q38.G 40.2,33.54 40.2,33.02 R57.2
BTN6_UP_SENSE  (1 unrouted)
  Top 0.152: 47.12,37.41 R56.1
BTN7_DOWN_CAP  (via drill 0.35)  (4 unrouted)
  Top 0.305: C24.1 71.48,25.61 | Q47.G 70.29,26.82 | v70.5,28.8 71.37,27.93
  Bottom 0.305: D24.K v70.5,28.8
BTN7_DOWN_CLR  (1 unrouted)
  Top 0.152: R71.2 69.08,24.69
BTN7_DOWN_SENSE  (1 unrouted)
BTN7_PIN1  (2 unrouted)
  Bottom 0.152: R67.2 61.62,31.44
  Bottom 0.305: D23.A 62.9,30.08 62.9,28.73 U12.P$4
  Bottom 0.457: U12.P$4 60.9,26.73 60.9,26.3 58.31,23.71
BTN7_PIN3  (3 unrouted)
  Bottom 0.152: 68.51,24.48 67.39,25.59
  Bottom 0.305: U12.P$3 64.71,27 65.98,27 67.39,25.59
  Bottom 0.457: U12.P$3 62.61,24.9 62.3,24.9 59.71,22.31
BTN7_UP_CAP  (via drill 0.35)  (3 unrouted)
  Top 0.305: 61.61,35.48 C23.1 64.22,34.4 v64.6,34.4 | Q45.G 61.48,35.55
  Bottom 0.305: D23.K 64.6,34.35
BTN7_UP_CLR
  Top 0.152: Q46.G 58.2,33.54 58.2,33.02 R69.2
BTN7_UP_SENSE  (1 unrouted)
  Top 0.152: 65.11,37.41 R68.1
BTN8_DOWN_CAP  (via drill 0.35)  (4 unrouted)
  Top 0.305: C28.1 17.48,43.61 | Q55.G 16.29,44.82 | v16.5,46.8 17.37,45.93
  Bottom 0.305: D28.K v16.5,46.8
BTN8_DOWN_CLR  (1 unrouted)
  Top 0.152: R83.2 15.08,42.69
BTN8_DOWN_SENSE  (1 unrouted)
BTN8_PIN1  (2 unrouted)
  Bottom 0.152: R79.2 7.62,49.44
  Bottom 0.305: D27.A 8.9,48.08 8.9,46.73 U14.P$4
  Bottom 0.457: U14.P$4 6.9,44.73 6.9,44.3 4.31,41.71
BTN8_PIN3  (3 unrouted)
  Bottom 0.152: 14.51,42.48 13.39,43.59
  Bottom 0.305: U14.P$3 10.71,45 11.98,45 13.39,43.59
  Bottom 0.457: U14.P$3 8.61,42.9 8.3,42.9 5.71,40.31
BTN8_UP_CAP  (via drill 0.35)  (3 unrouted)
  Top 0.305: 7.61,53.48 C27.1 10.22,52.4 v10.6,52.4 | Q53.G 7.48,53.55
  Bottom 0.305: D27.K 10.6,52.35
BTN8_UP_CLR
  Top 0.152: Q54.G 4.2,51.54 4.2,51.02 R81.2
BTN8_UP_SENSE  (1 unrouted)
  Top 0.152: 11.12,55.41 R80.1
BTN9_DOWN_CAP  (via drill 0.35)  (4 unrouted)
  Top 0.305: C32.1 35.48,43.61 | Q63.G 34.29,44.82 | v34.5,46.8 35.37,45.93
  Bottom 0.305: D32.K v34.5,46.8
BTN9_DOWN_CLR  (1 unrouted)
  Top 0.152: R95.2 33.08,42.69
BTN9_DOWN_SENSE  (1 unrouted)
BTN9_PIN1  (2 unrouted)
  Bottom 0.152: R91.2 25.61,49.44
  Bottom 0.305: D31.A 26.9,48.08 26.9,46.73 U16.P$4
  Bottom 0.457: U16.P$4 24.9,44.73 24.9,44.3 22.31,41.71
BTN9_PIN3  (3 unrouted)
  Bottom 0.152: 32.51,42.48 31.39,43.59
  Bottom 0.305: U16.P$3 28.71,45 29.98,45 31.39,43.59
  Bottom 0.457: U16.P$3 26.61,42.9 26.3,42.9 23.71,40.31
BTN9_UP_CAP  (via drill 0.35)  (3 unrouted)
  Top 0.305: 25.61,53.48 C31.1 28.22,52.4 v28.6,52.4 | Q61.G 25.48,53.55
  Bottom 0.305: D31.K 28.6,52.35
BTN9_UP_CLR
  Top 0.152: Q62.G 22.2,51.54 22.2,51.02 R93.2
BTN9_UP_SENSE  (1 unrouted)
  Top 0.152: 29.11,55.41 R92.1
BTN10_DOWN_CAP  (via drill 0.35)  (4 unrouted)
  Top 0.305: C36.1 53.48,43.61 | Q71.G 52.29,44.82 | v52.5,46.8 53.37,45.93
  Bottom 0.305: D36.K v52.5,46.8
BTN10_DOWN_CLR  (1 unrouted)
  Top 0.152: R107.2 51.08,42.69
BTN10_DOWN_SENSE  (1 unrouted)
BTN10_PIN1  (2 unrouted)
  Bottom 0.152: R103.2 43.62,49.44
  Bottom 0.305: D35.A 44.9,48.08 44.9,46.73 U18.P$4
  Bottom 0.457: U18.P$4 42.9,44.73 42.9,44.3 40.31,41.71
BTN10_PIN3  (3 unrouted)
  Bottom 0.152: 50.51,42.48 49.39,43.59
  Bottom 0.305: U18.P$3 46.71,45 47.98,45 49.39,43.59
  Bottom 0.457: U18.P$3 44.61,42.9 44.3,42.9 41.71,40.31
BTN10_UP_CAP  (via drill 0.35)  (3 unrouted)
  Top 0.305: 43.61,53.48 C35.1 46.22,52.4 v46.6,52.4 | Q69.G 43.48,53.55
  Bottom 0.305: D35.K 46.6,52.35
BTN10_UP_CLR
  Top 0.152: Q70.G 40.2,51.54 40.2,51.02 R105.2
BTN10_UP_SENSE  (1 unrouted)
  Top 0.152: 47.12,55.41 R104.1
BTN11_DOWN_CAP  (via drill 0.35)  (4 unrouted)
  Top 0.305: C40.1 71.48,43.61 | Q79.G 70.29,44.82 | v70.5,46.8 71.37,45.93
  Bottom 0.305: D40.K v70.5,46.8
BTN11_DOWN_CLR  (1 unrouted)
  Top 0.152: R119.2 69.08,42.69
BTN11_DOWN_SENSE  (1 unrouted)
BTN11_PIN1  (2 unrouted)
  Bottom 0.152: R115.2 61.62,49.44
  Bottom 0.305: D39.A 62.9,48.08 62.9,46.73 U20.P$4
  Bottom 0.457: U20.P$4 60.9,44.73 60.9,44.3 58.31,41.71
BTN11_PIN3  (3 unrouted)
  Bottom 0.152: 68.51,42.48 67.39,43.59
  Bottom 0.305: U20.P$3 64.71,45 65.98,45 67.39,43.59
  Bottom 0.457: U20.P$3 62.61,42.9 62.3,42.9 59.71,40.31
BTN11_UP_CAP  (via drill 0.35)  (3 unrouted)
  Top 0.305: 61.61,53.48 C39.1 64.22,52.4 v64.6,52.4 | Q77.G 61.48,53.55
  Bottom 0.305: D39.K 64.6,52.35
BTN11_UP_CLR
  Top 0.152: Q78.G 58.2,51.54 58.2,51.02 R117.2
BTN11_UP_SENSE  (1 unrouted)
  Top 0.152: 65.11,55.41 R116.1
BTN12_DOWN_CAP  (via drill 0.35)  (4 unrouted)
  Top 0.305: C14.1 17.48,61.61 | Q27.G 16.29,62.82 | v16.5,64.8 17.37,63.93
  Bottom 0.305: D14.K v16.5,64.8
BTN12_DOWN_CLR  (2 unrouted)
  Top 0.152: R41.2 15.08,60.69
BTN12_DOWN_SENSE  (2 unrouted)
BTN12_PIN1  (2 unrouted)
  Bottom 0.152: R37.2 7.62,67.44
  Bottom 0.305: D13.A 8.9,66.08 8.9,64.73 U7.P$4
  Bottom 0.457: U7.P$4 6.9,62.73 6.9,62.3 4.31,59.71
BTN12_PIN3  (3 unrouted)
  Bottom 0.152: 14.51,60.48 13.39,61.59
  Bottom 0.305: U7.P$3 10.71,63 11.98,63 13.39,61.59
  Bottom 0.457: U7.P$3 8.61,60.9 8.3,60.9 5.71,58.31
BTN12_UP_CAP  (via drill 0.35)  (3 unrouted)
  Top 0.305: 7.61,71.48 C13.1 10.22,70.4 v10.6,70.4 | Q25.G 7.48,71.55
  Bottom 0.305: D13.K 10.6,70.35
BTN12_UP_CLR  (1 unrouted)
  Top 0.152: Q26.G 4.2,69.54 4.2,69.02 R39.2
BTN12_UP_SENSE  (2 unrouted)
  Top 0.152: 11.12,73.42 R38.1
BTN13_DOWN_CAP  (via drill 0.35)  (4 unrouted)
  Top 0.305: C22.1 35.48,61.61 | Q43.G 34.29,62.82 | v34.5,64.8 35.37,63.93
  Bottom 0.305: D22.K v34.5,64.8
BTN13_DOWN_CLR  (1 unrouted)
  Top 0.152: R65.2 33.08,60.69
BTN13_DOWN_SENSE  (1 unrouted)
BTN13_PIN1  (2 unrouted)
  Bottom 0.152: R61.2 25.61,67.44
  Bottom 0.305: D21.A 26.9,66.08 26.9,64.73 U11.P$4
  Bottom 0.457: U11.P$4 24.9,62.73 24.9,62.3 22.31,59.71
BTN13_PIN3  (3 unrouted)
  Bottom 0.152: 32.51,60.48 31.39,61.59
  Bottom 0.305: U11.P$3 28.71,63 29.98,63 31.39,61.59
  Bottom 0.457: U11.P$3 26.61,60.9 26.3,60.9 23.71,58.31
BTN13_UP_CAP  (via drill 0.35)  (3 unrouted)
  Top 0.305: 25.61,71.48 C21.1 28.22,70.4 v28.6,70.4 | Q41.G 25.48,71.55
  Bottom 0.305: D21.K 28.6,70.35
BTN13_UP_CLR
  Top 0.152: Q42.G 22.2,69.54 22.2,69.02 R63.2
BTN13_UP_SENSE  (2 unrouted)
  Top 0.152: 29.11,73.42 R62.1
BTN14_DOWN_CAP  (via drill 0.35)  (4 unrouted)
  Top 0.305: C30.1 53.48,61.61 | Q59.G 52.29,62.82 | v52.5,64.8 53.37,63.93
  Bottom 0.305: D30.K v52.5,64.8
BTN14_DOWN_CLR  (1 unrouted)
  Top 0.152: R89.2 51.08,60.69
BTN14_DOWN_SENSE  (1 unrouted)
BTN14_PIN1  (2 unrouted)
  Bottom 0.152: R85.2 43.62,67.44
  Bottom 0.305: D29.A 44.9,66.08 44.9,64.73 U15.P$4
  Bottom 0.457: U15.P$4 42.9,62.73 42.9,62.3 40.31,59.71
BTN14_PIN3  (3 unrouted)
  Bottom 0.152: 50.51,60.48 49.39,61.59
  Bottom 0.305: U15.P$3 46.71,63 47.98,63 49.39,61.59
  Bottom 0.457: U15.P$3 44.61,60.9 44.3,60.9 41.71,58.31
BTN14_UP_CAP  (via drill 0.35)  (3 unrouted)
  Top 0.305: 43.61,71.48 C29.1 46.22,70.4 v46.6,70.4 | Q57.G 43.48,71.55
  Bottom 0.305: D29.K 46.6,70.35
BTN14_UP_CLR
  Top 0.152: Q58.G 40.2,69.54 40.2,69.02 R87.2
BTN14_UP_SENSE  (1 unrouted)
  Top 0.152: 47.12,73.42 R86.1
BTN15_DOWN_CAP  (via drill 0.35)  (4 unrouted)
  Top 0.305: C38.1 71.48,61.61 | Q75.G 70.29,62.82 | v70.5,64.8 71.37,63.93
  Bottom 0.305: D38.K v70.5,64.8
BTN15_DOWN_CLR  (1 unrouted)
  Top 0.152: R113.2 69.08,60.69
BTN15_DOWN_SENSE  (1 unrouted)
BTN15_PIN1  (2 unrouted)
  Bottom 0.152: R109.2 61.62,67.44
  Bottom 0.305: D37.A 62.9,66.08 62.9,64.73 U19.P$4
  Bottom 0.457: U19.P$4 60.9,62.73 60.9,62.3 58.31,59.71
BTN15_PIN3  (3 unrouted)
  Bottom 0.152: 68.51,60.48 67.39,61.59
  Bottom 0.305: U19.P$3 64.71,63 65.98,63 67.39,61.59
  Bottom 0.457: U19.P$3 62.61,60.9 62.3,60.9 59.71,58.31
BTN15_UP_CAP  (via drill 0.35)  (3 unrouted)
  Top 0.305: 61.61,71.48 C37.1 64.22,70.4 v64.6,70.4 | Q73.G 61.48,71.55
  Bottom 0.305: D37.K 64.6,70.35
BTN15_UP_CLR
  Top 0.152: Q74.G 58.2,69.54 58.2,69.02 R111.2
BTN15_UP_SENSE  (1 unrouted)
  Top 0.152: 65.11,73.42 R110.1
GND  (via drill 0.35)  (1 unrouted)
  other vias: 15.5,13.8 15.5,11.9 6.2,12.9 10.7,18.1 19.5,9.3 15.2,4.1 13.7,13.7 11.5,17.4 7.7,16.2 33.5,13.8 33.5,11.9 24.2,12.9 28.7,18.1 37.5,9.3 33.2,4.1 31.7,13.7 29.5,17.4 25.7,16.2 51.5,13.8 51.5,11.9 42.2,12.9 46.7,18.1 55.5,9.3 51.2,4.1 49.7,13.7 47.5,17.4 43.7,16.2 69.5,13.8 69.5,11.9 60.2,12.9 64.7,18.1 73.5,9.3 69.2,4.1 67.7,13.7 65.5,17.4 61.7,16.2 15.5,31.8 15.5,29.9 6.2,30.9 10.7,36.1 19.5,27.3 15.2,22.1 13.7,31.7 11.5,35.4 7.7,34.2 33.5,31.8 33.5,29.9 24.2,30.9 28.7,36.1 37.5,27.3 33.2,22.1 31.7,31.7 29.5,35.4 25.7,34.2 51.5,31.8 51.5,29.9 42.2,30.9 46.7,36.1 55.5,27.3 51.2,22.1 49.7,31.7 47.5,35.4 43.7,34.2 69.5,31.8 69.5,29.9 60.2,30.9 64.7,36.1 73.5,27.3 69.2,22.1 67.7,31.7 65.5,35.4 61.7,34.2 15.5,49.8 15.5,47.9 6.2,48.9 10.7,54.1 19.5,45.3 15.2,40.1 13.7,49.7 11.5,53.4 7.7,52.2 33.5,49.8 33.5,47.9 24.2,48.9 28.7,54.1 37.5,45.3 33.2,40.1 31.7,49.7 29.5,53.4 25.7,52.2 51.5,49.8 51.5,47.9 42.2,48.9 46.7,54.1 55.5,45.3 51.2,40.1 49.7,49.7 47.5,53.4 43.7,52.2 69.5,49.8 69.5,47.9 60.2,48.9 64.7,54.1 73.5,45.3 69.2,40.1 67.7,49.7 65.5,53.4 61.7,52.2 15.5,67.8 15.5,65.9 6.2,66.9 10.7,72.1 19.5,63.3 15.2,58.1 13.7,67.7 11.5,71.4 7.7,70.2 33.5,67.8 33.5,65.9 24.2,66.9 28.7,72.1 37.5,63.3 33.2,58.1 31.7,67.7 29.5,71.4 25.7,70.2 51.5,67.8 51.5,65.9 42.2,66.9 46.7,72.1 55.5,63.3 51.2,58.1 49.7,67.7 47.5,71.4 43.7,70.2 69.5,67.8 69.5,65.9 60.2,66.9 64.7,72.1 73.5,63.3 69.2,58.1 67.7,67.7 65.5,71.4 61.7,70.2
  pour Top: 0,0 160,0 160,100 0,100
  pour Bottom: 0,0 160,0 160,100 0,100
HARVEST  (15 unrouted)
VCC  (via drill 0.35)  (32 unrouted)
  Top 0.152: v17.9,12.6 18.6,12.6 18.8,12.8 19.14,12.8 R12.2 | v12.6,17.9 12.6,18.6 12.8,18.8 12.8,19.14 R8.2 | v35.9,12.6 36.6,12.6 36.8,12.8 37.14,12.8 R18.2 | v30.6,17.9 30.6,18.6 30.8,18.8 30.8,19.14 R14.2 | v53.9,12.6 54.6,12.6 54.8,12.8 55.14,12.8 R24.2 | v48.6,17.9 48.6,18.6 48.8,18.8 48.8,19.14 R20.2 | v71.9,12.6 72.6,12.6 72.8,12.8 73.14,12.8 R30.2 | v66.6,17.9 66.6,18.6 66.8,18.8 66.8,19.14 R26.2 | v17.9,30.6 18.6,30.6 18.8,30.8 19.14,30.8 R36.2 | v12.6,35.9 12.6,36.6 12.8,36.8 12.8,37.14 R32.2 | v35.9,30.6 36.6,30.6 36.8,30.8 37.14,30.8 R48.2 | v30.6,35.9 30.6,36.6 30.8,36.8 30.8,37.14 R44.2 | v53.9,30.6 54.6,30.6 54.8,30.8 55.14,30.8 R60.2 | v48.6,35.9 48.6,36.6 48.8,36.8 48.8,37.14 R56.2 | v71.9,30.6 72.6,30.6 72.8,30.8 73.14,30.8 R72.2 | v66.6,35.9 66.6,36.6 66.8,36.8 66.8,37.14 R68.2 | v17.9,48.6 18.6,48.6 18.8,48.8 19.14,48.8 R84.2 | v12.6,53.9 12.6,54.6 12.8,54.8 12.8,55.14 R80.2 | v35.9,48.6 36.6,48.6 36.8,48.8 37.14,48.8 R96.2 | v30.6,53.9 30.6,54.6 30.8,54.8 30.8,55.14 R92.2 | v53.9,48.6 54.6,48.6 54.8,48.8 55.14,48.8 R108.2 | v48.6,53.9 48.6,54.6 48.8,54.8 48.8,55.14 R104.2 | v71.9,48.6 72.6,48.6 72.8,48.8 73.14,48.8 R120.2 | v66.6,53.9 66.6,54.6 66.8,54.8 66.8,55.14 R116.2 | v17.9,66.6 18.6,66.6 18.8,66.8 19.14,66.8 R42.2 | v12.6,71.9 12.6,72.6 12.8,72.8 12.8,73.14 R38.2 | v35.9,66.6 36.6,66.6 36.8,66.8 37.14,66.8 R66.2 | v30.6,71.9 30.6,72.6 30.8,72.8 30.8,73.14 R62.2 | v53.9,66.6 54.6,66.6 54.8,66.8 55.14,66.8 R90.2 | v48.6,71.9 48.6,72.6 48.8,72.8 48.8,73.14 R86.2 | v71.9,66.6 72.6,66.6 72.8,66.8 73.14,66.8 R114.2 | v66.6,71.9 66.6,72.6 66.8,72.8 66.8,73.14 R110.2